# Altium project HIL_RIG_Hardware.PrjPcb (part 10 of 11)

## Sheet  3V3_High_Current.SchDoc
size A4; SheetNumber: 26; SheetTotal: 29; SPICEModelCacheDXEXORCN: <root> / <DocumentId>DXEXORCN</DocumentId> / </root>
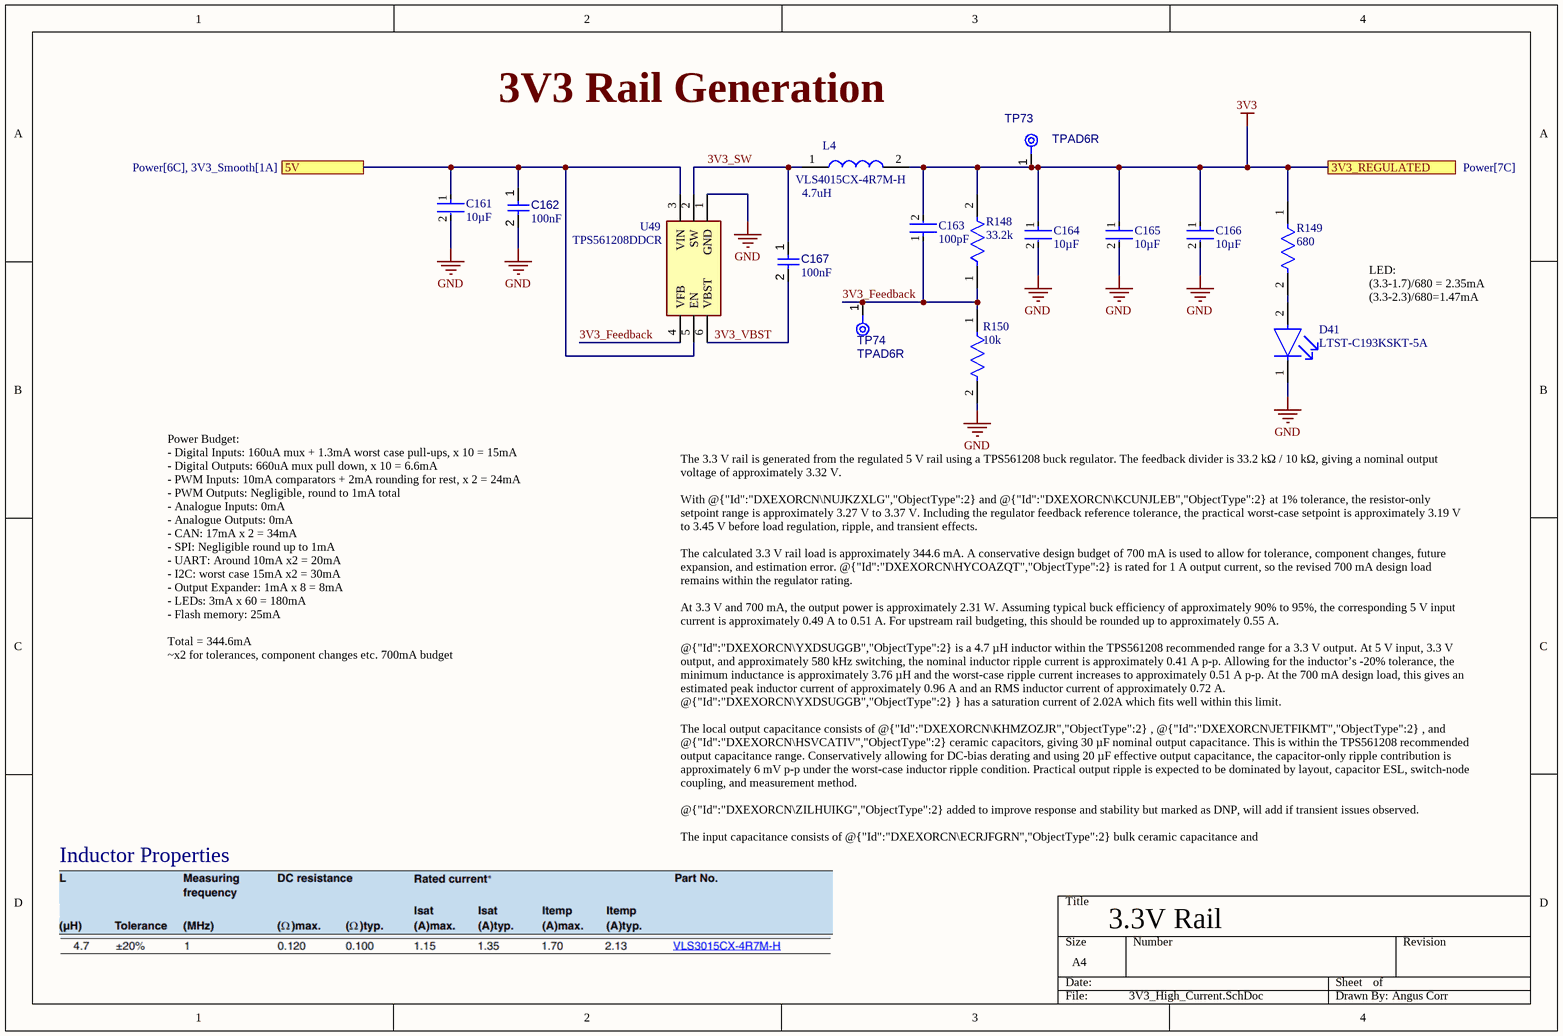
[diagram p24:  3V3_High_Current.SchDoc]

### Parts
C161  value 10µF  [FP-GRM31C-0_2-e0_3_0_8-IPC_C]  (hidden comment: GRM31CR71E106KA12L)
C162  value 100nF  [CAPC1608X90X40NL10T20]  (hidden comment: Capacitor 100 nF +/-10% 50 V 0603)
C163  value 100pF  [FP-C0603C-CF-IPC_B]  (hidden comment: C0603C101F5HACTU)
C164  value 10µF  [FP-GRM31C-0_2-e0_3_0_8-IPC_C]  (hidden comment: GRM31CR71E106KA12L)
C165  value 10µF  [FP-GRM31C-0_2-e0_3_0_8-IPC_C]  (hidden comment: GRM31CR71E106KA12L)
C166  value 10µF  [FP-GRM31C-0_2-e0_3_0_8-IPC_C]  (hidden comment: GRM31CR71E106KA12L)
C167  value 100nF  [CAPC1608X90X40NL10T20]  (hidden comment: Capacitor 100 nF +/-10% 50 V 0603)
D41  LTST-C193KSKT-5A  [FP-LTST-C193KGKT-5A-MFG]
L4  VLS4015CX-4R7M-H  [VLS4015CX100MH]
R148  value 33.2k  [FP-RT0603-IPC_C]  (hidden comment: RT0603BRD0733K2L)
R149  value 680  [FP-CRCW0603-e3-IPC_C]  (hidden comment: CRCW0603680RJNEA)
R150  value 10k  [FP-RT0603-IPC_C]  (hidden comment: RT0603BRD0710KL)
TP73  TPAD6R  [TP06R]  (no BOM)
TP74  TPAD6R  [TP06R]  (no BOM)
U49  TPS561208DDCR  [SOT95P280X110-6N]

### Ports
3V3_REGULATED (see Power[7C]), 5V (see Power[6C], 3V3_Smooth[1A])

### Nets
3V3: C163.2 C164.1 C165.1 C166.1 L4.2 R148.2 R149.1 TP73.1(TP) ; port 3V3_REGULATED
GND: C161.2 C162.2 C164.2 C165.2 C166.2 D41.1(C) R150.2 U49.1(GND)
3V3_Feedback: C163.1 R148.1 R150.1 TP74.1(TP) U49.4(VFB)
3V3_SW: C167.1 L4.1 U49.2(SW)
3V3_VBST: C167.2 U49.6(VBST)
NetC161_1: C161.1 C162.1 U49.3(VIN) U49.5(EN) ; port 5V
NetD41_2: D41.2(A) R149.2

### Notes on the sheet
- 3V3 Rail Generation
- (near L4) 4.7uH
- LED:
  (3.3-1.7)/680 = 2.35mA
  (3.3-2.3)/680=1.47mA
- Power Budget:
  - Digital Inputs: 160uA mux + 1.3mA worst case pull-ups, x 10 = 15mA
  - Digital Outputs: 660uA mux pull down, x 10 = 6.6mA
  - PWM Inputs: 10mA comparators + 2mA rounding for rest, x 2 = 24mA
  - PWM Outputs: Negligible, round to 1mA total
  - Analogue Inputs: 0mA
  - Analogue Outputs: 0mA
  - CAN: 17mA x 2 = 34mA
  - SPI: Negligible round up to 1mA
  - UART: Around 10mA x2 = 20mA
  - I2C: worst case 15mA x2 = 30mA
  - Output Expander: 1mA x 8 = 8mA
  - LEDs: 3mA x 60 = 180mA
  - Flash memory: 25mA
  Total = 344.6mA
  ~x2 for tolerances, component changes etc. 700mA budget
- The 3.3 V rail is generated from the regulated 5 V rail using a TPS561208 buck regulator. The feedback divider is 33.2 kΩ / 10 kΩ, giving a nominal output voltage of approximately 3.32 V.
  With @{"Id":"DXEXORCN\NUJKZXLG","ObjectType":2} and @{"Id":"DXEXORCN\KCUNJLEB","ObjectType":2} at 1% tolerance, the resistor-only setpoint range is approximately 3.27 V to 3.37 V. Including the regulator feedback reference tolerance, the practical worst-case setpoint is approximately 3.19 V to 3.45 V before load regulation, ripple, and transient effects.
  The calculated 3.3 V rail load is approximately 344.6 mA. A conservative design budget of 700 mA is used to allow for tolerance, component changes, future expansion, and estimation error. @{"Id":"DXEXORCN\HYCOAZQT","ObjectType":2} is rated for 1 A output current, so the revised 700 mA design load remains within the regulator rating.
  At 3.3 V and 700 mA, the output power is approximately 2.31 W. Assuming typical buck efficiency of approximately 90% to 95%, the corresponding 5 V input current is approximately 0.49 A to 0.51 A. For upstream rail budgeting, this should be rounded up to approximately 0.55 A.
  @{"Id":"DXEXORCN\YXDSUGGB","ObjectType":2} is a 4.7 µH inductor within the TPS561208 recommended range for a 3.3 V output. At 5 V input, 3.3 V output, and approximately 580 kHz switching, the nominal inductor ripple current is approximately 0.41 A p-p. Allowing for the inductor’s -20% tolerance, the minimum inductance is approximately 3.76 µH and the worst-case ripple current increases to approximately 0.51 A p-p. At the 700 mA design load, this gives an estimated peak inductor current of approximately 0.96 A and an RMS inductor current of approximately 0.72 A. @{"Id":"DXEXORCN\YXDSUGGB","ObjectType":2} } has a saturation current of 2.02A which fits well within this limit.
  The local output capacitance consists of @{"Id":"DXEXORCN\KHMZOZJR","ObjectType":2} , @{"Id":"DXEXORCN\JETFIKMT","ObjectType":2} , and @{"Id":"DXEXORCN\HSVCATIV","ObjectType":2} ceramic capacitors, giving 30 µF nominal output capacitance. This is within the TPS561208 recommended output capacitance range. Conservatively allowing for DC-bias derating and using 20 µF effective output capacitance, the capacitor-only ripple contribution is approximately 6 mV p-p under the worst-case inductor ripple condition. Practical output ripple is expected to be dominated by layout, capacitor ESL, switch-node coupling, and measurement method.
  @{"Id":"DXEXORCN\ZILHUIKG","ObjectType":2} added to improve response and stability but marked as DNP, will add if transient issues observed.
  The input capacitance consists of @{"Id":"DXEXORCN\ECRJFGRN","ObjectType":2} bulk ceramic capacitance and @{"Id":"DXEXORCN\CNOYWFMO","ObjectType":2} high-frequency ceramic decoupling. This provides local switching-current decoupling at the regulator input. At the revised 700 mA 3.3 V rail budget, the converter is expected to draw approximately 0.49 A to 0.51 A from the regulated 5 V rail.
- Inductor Properties
- 3.3V Rail
- Angus Corr

### Library data of the parts
C161 C164-C166 = CMP-001-00139-1: 25V 10uF X7R ±10% 1206 Multilayer Ceramic Capacitors MLCC - SMD/SMT ROHS; Manufacturer Lifecycle Status: IN PRODUCTION; Min Operating Temperature: -55°C; Case/Package: 1206; Pins: 2; Voltage Rating: 25V; Max Operating Temperature: 125°C; Tolerance: 10%; Mounting Technology: Surface Mount; Case Code (Imperial): 1206; Case Code (Metric): 3216; China RoHS: Compliant; Depth: 1.6mm; Dielectric Material: Ceramic; Dielectric: X7R; Height: 1.6mm; Lead Free: Lead Free; Length: 3.2mm; Lifecycle Status: Production; Material: Ceramic; Number of Terminals: 2; Packaging: Cut Tape; Radiation Hardening: No; REACH SVHC: Yes; RoHS: Compliant; Schedule B: 8532240020, 8532240020; Termination: SMD/SMT; Thickness: 1.6mm; Voltage Rating (DC): 25V; Voltage: 25V; Width: 1.6mm
C162 C167 = CMP-001-00017-6: Chip Capacitor, 100 nF, +/- 10%, 50 V, 0603 (1608 Metric); Voltage Rating: 50V; Capacitor Type: Ceramic; Tolerance: 10%; Mounting Technology: SM; Max Operating Temperature: 125°C; RoHS Compliant: True; Pins: 2; Case/Package: 0603; Min Operating Temperature: -55°C
C163 = CMP-001-00115-1: Multilayer Ceramic Capacitors MLCC - SMD/SMT 50V 100pF X8R 0603 1%; Temperature Coefficient: 30ppm/°C; Lead Free: Lead Free; Width: 800µm; Schedule B: 8532240020, 8532240020; Introduction Date: 2017-10-02; Harmonized Tariff Schedule (HTS) Code: 8532.24.00.20; Voltage Rating (DC): 50V; Lifecycle Status: Production; Number of Terminals: 2; Height: 800µm; REACH SVHC: Yes; Dielectric Material: Ceramic; Country of Origin: Mexico; Voltage Rating: 50V; Mounting Technology: Surface Mount; Length: 1.6mm; China RoHS: Compliant; RoHS: Compliant; Case/Package: 0603; Max Operating Temperature: 150°C; Export Control Classification Number (ECCN) Code: EAR99; Dielectric: X8R; Material: Ceramic; Min Operating Temperature: -55°C
D41 = CMP-007-00044-1: LED yellow 0603 wavelength 587~594.5nm light intensity 7.1~45mcd Front Mounting; Shape: Rectangular; Power Dissipation: 50mW; Peak Wavelength: 591nm; Number of Circuits: 1; Lens Style: Colorless, Diffused, Rectangular; Test Current: 5mA; Forward Voltage: 2.3V; Lens Transparency: Clear; Lens Color: Clear, Colorless; Viewing Angle: 130°; Forward Current: 30mA; Reverse Voltage: 5V; Luminous Intensity: 26.05mcd; Schedule B: 8541402000, 8541402000; Introduction Date: 2007-04-09; Min Operating Temperature: -55°C; RoHS: Compliant; Terminal Pitch: 1.5mm; Case/Package: 0603; Width: 800µm; Dominant Wavelength: 594.5nm; Pins: 2; Case Code (Imperial): 0603; Height: 350µm; Length: 1.6mm; Color: Yellow; Lead Free: Lead Free; Max Operating Temperature: 85°C; Wavelength: 594.5nm; Harmonized Tariff Schedule (HTS) Code: 8541.40.20.00; China RoHS: Compliant; Illumination Color: Yellow; Number of Terminals: 2; Radiation Hardening: No; Case Code (Metric): 1608; Number of LEDs: 1; Depth: 800µm; Lifecycle Status: Production; REACH SVHC: Yes; Mounting Technology: Surface Mount; Number of Elements: 1
L4 = CMP-006-00029-1: SMD / SMT Inductors (Coils); Manufacturer_Name: TDK; Design Item ID: VLS4015CX-4R7M-H; Manufacturer_Part_Number: VLS4015CX-4R7M-H; Datasheet Link: https://product.tdk.com/system/files/dam/doc/product/inductor/inductor/smd/catalog/inductor_automotive_power_vls4015cx-h_en.pdf; Height: 1.5mm; Source: MAX17643ATC+.SchLib; Mouser Price/Stock: https://www.mouser.co.uk/ProductDetail/TDK/VLS4015CX-4R7M-H?qs=Li%252BoUPsLEnsP0JLzqrKQYg%3D%3D; Mouser Part Number: 810-VLS4015CX-4R7M-H
R148 = CMP-009-00323-1: 100mW Thin Film Resistor 75V ±25ppm/℃ ±0.1% 33.2kΩ 0603 Chip Resistor - Surface Mount ROHS; Temperature Coefficient: 25ppm/°C; Voltage Rating (DC): 50V; Mounting Technology: Surface Mount; Working Voltage: 75V; Length: 1.6mm; Lead Free: Lead Free; REACH SVHC: Yes; Composition: Thin Film; Voltage Rating: 75V; Height: 450µm; Termination: SMD/SMT; Lifecycle Status: Production; Military Standard: Not; Depth: 800µm; Case/Package: 0603; Min Operating Temperature: -55°C; Number of Terminals: 2; Max Power Dissipation: 100mW; China RoHS: Non-Compliant; Number of Terminations: 2; Case Code (Imperial): 0603; Width: 800µm; Max Operating Temperature: 155°C; Tolerance: 0.1%; Power Rating: 100mW; Radiation Hardening: No; RoHS: Compliant; Contact Plating: Tin
R149 = CMP-009-00300-1: Fixed Resistor, Metal Glaze/Thick Film, 0.1W, 680ohm, 75V, 5% +/-Tol, Surface Mount, 0603; Power Rating: 100mW; Temperature Coefficient: 200ppm/°C; Case/Package: 0603; Voltage Rating (DC): 75V; Lifecycle Status: Production; Depth: 850µm; Introduction Date: 2005-02-16; Number of Terminations: 2; Composition: Thick Film; Export Control Classification Number (ECCN) Code: EAR99; RoHS: Compliant; Packaging: Cut Tape; Max Power Dissipation: 100mW; Max Operating Temperature: 155°C; Harmonized Tariff Schedule (HTS) Code: 8533.21.00.30; Voltage Rating: 75V; China RoHS: Non-Compliant; Width: 850µm; Height: 450µm; Schedule B: 8533210045, 8533210045; Mounting Technology: Surface Mount; Pins: 2; Radiation Hardening: No; Features: Automotive AEC-Q200; Min Operating Temperature: -55°C; Lead Free: Lead Free; Working Voltage: 75V; Military Standard: Not; Tolerance: 5%; Case Code (Imperial): 0603; Number of Terminals: 2; Weight: 2.012816mg; REACH SVHC: Yes; Length: 1.55mm; Ratings: AEC-Q200; Contact Plating: Tin; Termination: SMD/SMT; Country of Origin: Israel, Taiwan
R150 = CMP-009-00322-1: Res Thin Film 0603 10K Ohm 0.1% 1/10W |25ppm/|C SMD Paper T/R; Voltage Rating: 75V; Max Power Dissipation: 100mW; Temperature Coefficient: 25ppm/°C; Min Operating Temperature: -55°C; Case/Package: 0603; Mounting Technology: Surface Mount; Max Operating Temperature: 155°C; Tolerance: 0.1%; Case Code (Imperial): 0603; China RoHS: Non-Compliant; Composition: Thin Film; Country of Origin: Mainland China, Taiwan; Depth: 800µm; Export Control Classification Number (ECCN) Code: EAR99; Features: Moisture Resistant; Harmonized Tariff Schedule (HTS) Code: 8533.21.00.30; Height: 450µm; Introduction Date: 2008-06-09; Lead Free: Lead Free; Length: 1.6mm; Lifecycle Status: Production; Military Standard: Not; Number of Terminals: 2; Number of Terminations: 2; Power Rating: 100mW; REACH SVHC: Yes; RoHS: Compliant; Schedule B: 8533210045, 8533210045; Termination: SMD/SMT; Voltage Rating (DC): 75V; Weight: 2.012816mg; Width: 800µm; Working Voltage: 75V
TP73 TP74 = CMP-00028-00002-2: 0.6mm round; Pins: 1
U49 = CMP-033-000001-1: 4.5V to 17V Input; Manufacturer_Name: Texas Instruments; Mouser Part Number: 595-TPS561208DDCR; Arrow Price/Stock: https://www.arrow.com/en/products/tps561208ddcr/texas-instruments?utm_currency=USD&region=nac; Manufacturer_Part_Number: TPS561208DDCR; Design Item ID: TPS561208DDCR; Height: 1.1mm; Datasheet Link: http://www.ti.com/lit/gpn/tps561208; Mouser Price/Stock: https://www.mouser.co.uk/ProductDetail/Texas-Instruments/TPS561208DDCR?qs=5aG0NVq1C4wGRU8Kylr4iw%3D%3D; Source: MAX17643ATC+.SchLib; Arrow Part Number: TPS561208DDCR

## Sheet  Output_Expander.SchDoc
size A3; SheetNumber: 28; SheetTotal: 29
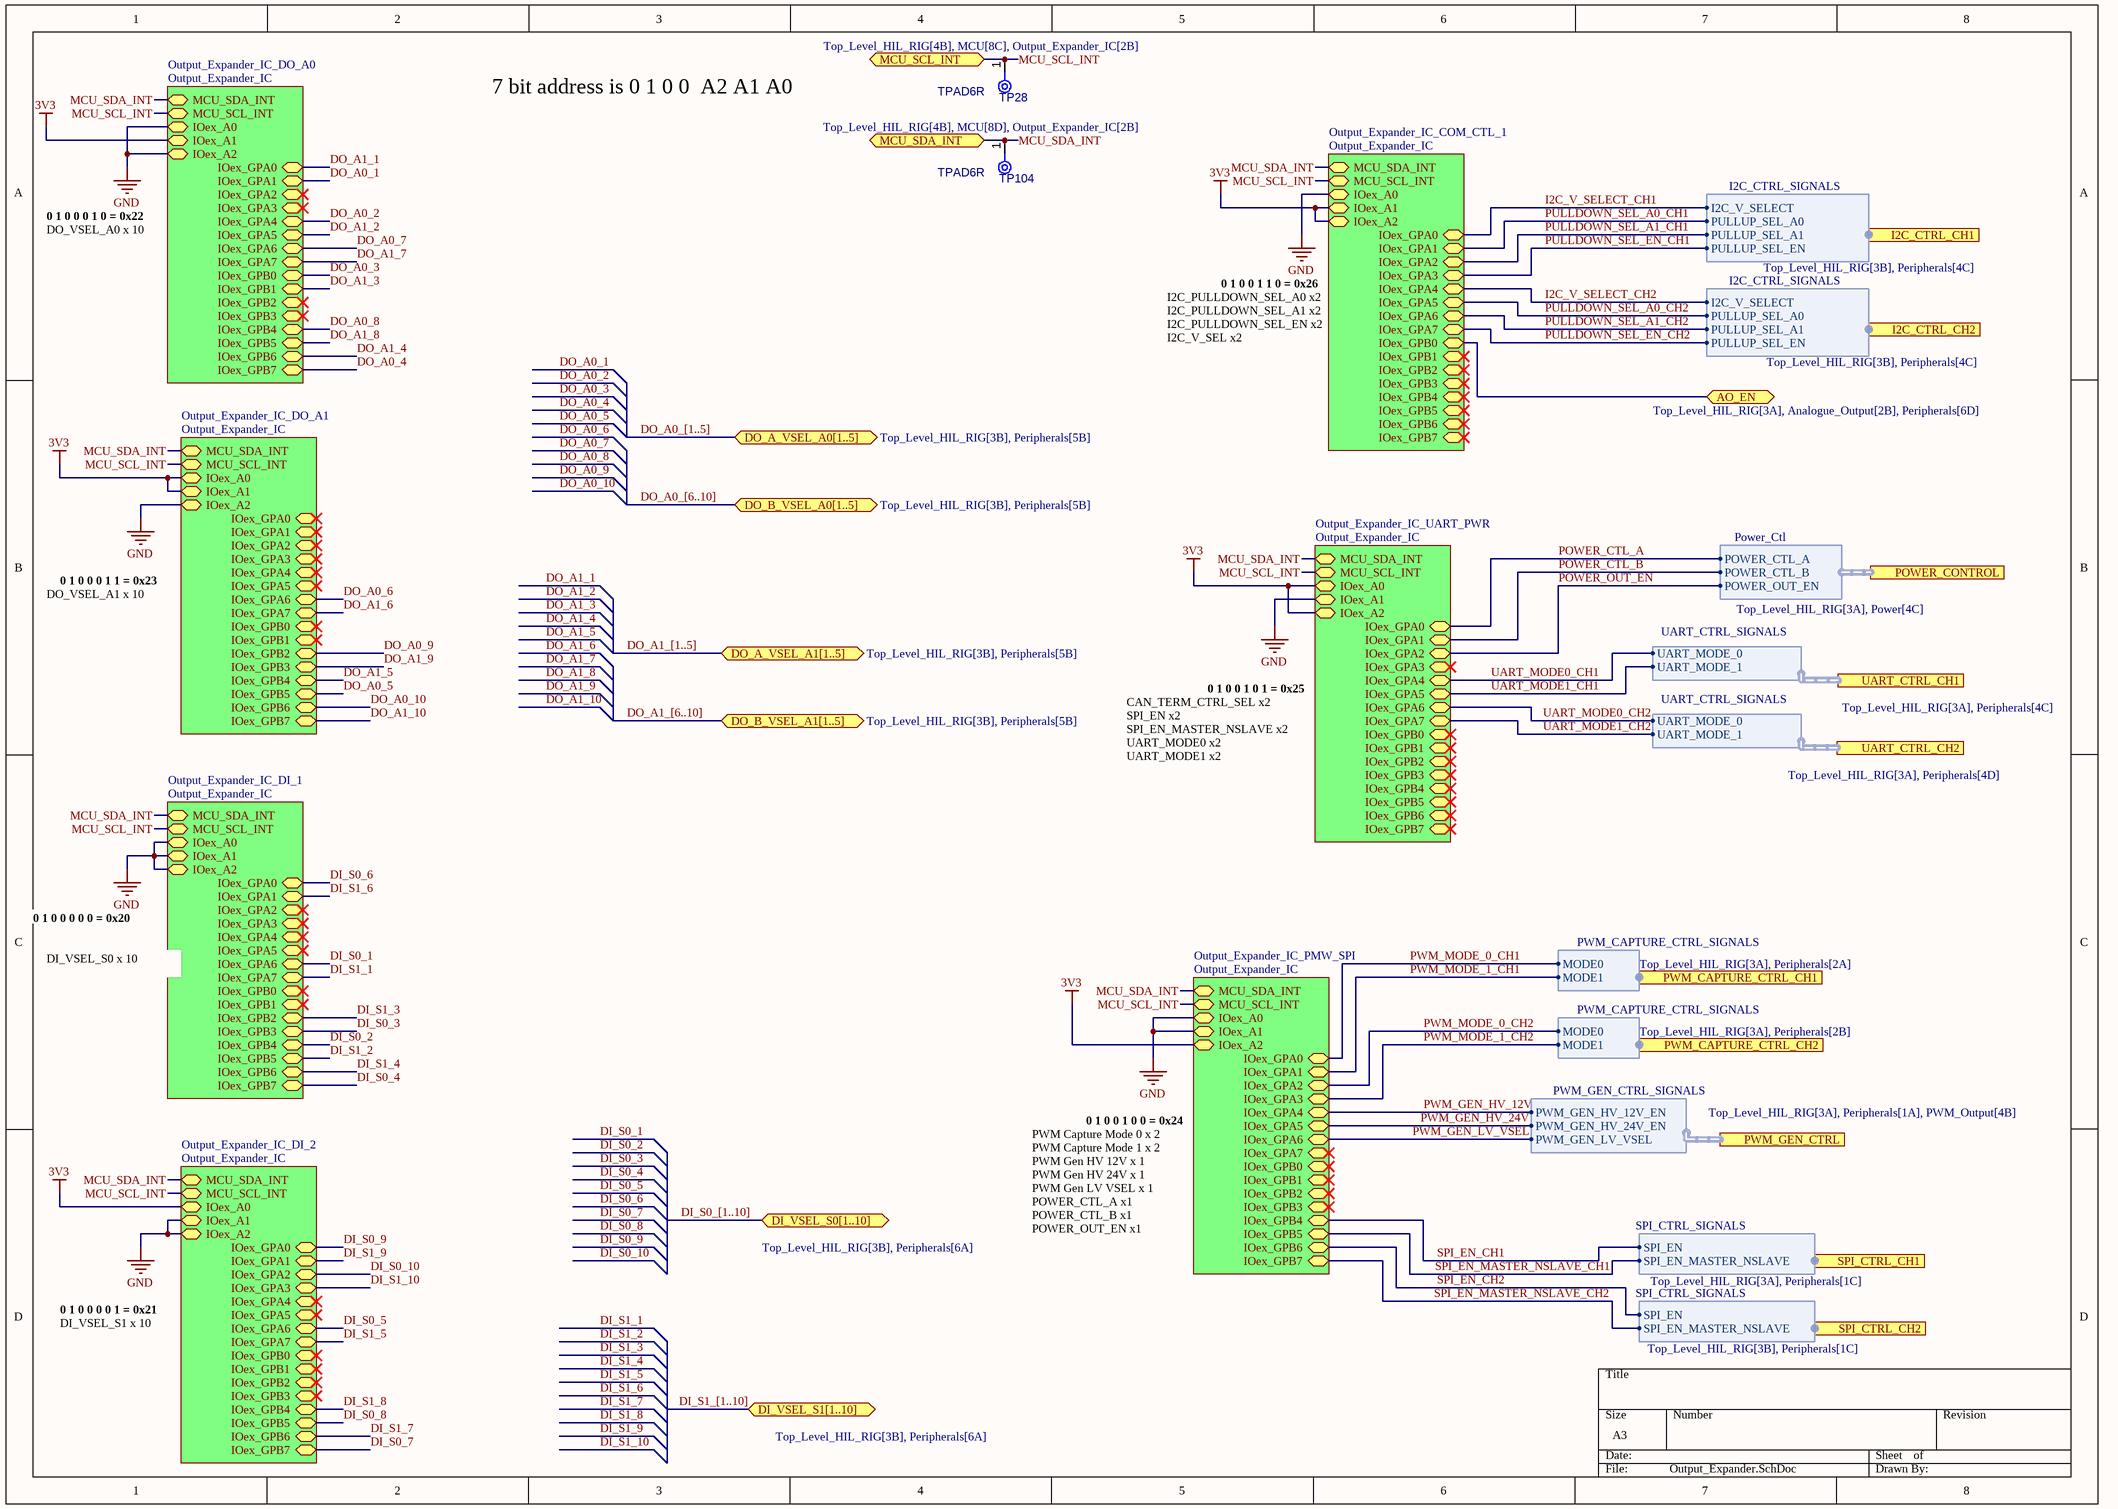
[diagram p25:  Output_Expander.SchDoc]

### Parts
TP28  TPAD6R  [TP06R]  (no BOM)
TP104  TPAD6R  [TP06R]  (no BOM)

### Sub-sheets
Output_Expander_IC_COM_CTL_1 = Output_Expander_IC (file not in this document): MCU_SDA_INT (bidir), MCU_SCL_INT (bidir), IOex_A0 (bidir), IOex_A1 (bidir), IOex_A2 (bidir), IOex_GPA0 (bidir), IOex_GPA1 (bidir), IOex_GPA2 (bidir), IOex_GPA3 (bidir), IOex_GPA4 (bidir), IOex_GPA5 (bidir), IOex_GPA6 (bidir), IOex_GPA7 (bidir), IOex_GPB0 (bidir), IOex_GPB1 (bidir), IOex_GPB3 (bidir), IOex_GPB4 (bidir), IOex_GPB5 (bidir), IOex_GPB6 (bidir), IOex_GPB2 (bidir), IOex_GPB7 (bidir)
Output_Expander_IC_DI_1 = Output_Expander_IC (file not in this document): MCU_SDA_INT (bidir), MCU_SCL_INT (bidir), IOex_A0 (bidir), IOex_A1 (bidir), IOex_A2 (bidir), IOex_GPA0 (bidir), IOex_GPA1 (bidir), IOex_GPA2 (bidir), IOex_GPA3 (bidir), IOex_GPA4 (bidir), IOex_GPA5 (bidir), IOex_GPA6 (bidir), IOex_GPA7 (bidir), IOex_GPB0 (bidir), IOex_GPB1 (bidir), IOex_GPB3 (bidir), IOex_GPB4 (bidir), IOex_GPB5 (bidir), IOex_GPB6 (bidir), IOex_GPB2 (bidir), IOex_GPB7 (bidir)
Output_Expander_IC_DI_2 = Output_Expander_IC (file not in this document): MCU_SDA_INT (bidir), MCU_SCL_INT (bidir), IOex_A0 (bidir), IOex_A1 (bidir), IOex_A2 (bidir), IOex_GPA0 (bidir), IOex_GPA1 (bidir), IOex_GPA2 (bidir), IOex_GPA3 (bidir), IOex_GPA4 (bidir), IOex_GPA5 (bidir), IOex_GPA6 (bidir), IOex_GPA7 (bidir), IOex_GPB0 (bidir), IOex_GPB1 (bidir), IOex_GPB3 (bidir), IOex_GPB4 (bidir), IOex_GPB5 (bidir), IOex_GPB6 (bidir), IOex_GPB2 (bidir), IOex_GPB7 (bidir)
Output_Expander_IC_DO_A0 = Output_Expander_IC (file not in this document): MCU_SDA_INT (bidir), MCU_SCL_INT (bidir), IOex_A0 (bidir), IOex_A1 (bidir), IOex_A2 (bidir), IOex_GPA0 (bidir), IOex_GPA1 (bidir), IOex_GPA2 (bidir), IOex_GPA3 (bidir), IOex_GPA4 (bidir), IOex_GPA5 (bidir), IOex_GPA6 (bidir), IOex_GPA7 (bidir), IOex_GPB0 (bidir), IOex_GPB1 (bidir), IOex_GPB3 (bidir), IOex_GPB4 (bidir), IOex_GPB5 (bidir), IOex_GPB6 (bidir), IOex_GPB2 (bidir), IOex_GPB7 (bidir)
Output_Expander_IC_DO_A1 = Output_Expander_IC (file not in this document): MCU_SDA_INT (bidir), MCU_SCL_INT (bidir), IOex_A0 (bidir), IOex_A1 (bidir), IOex_A2 (bidir), IOex_GPA0 (bidir), IOex_GPA1 (bidir), IOex_GPA2 (bidir), IOex_GPA3 (bidir), IOex_GPA4 (bidir), IOex_GPA5 (bidir), IOex_GPA6 (bidir), IOex_GPB0 (bidir), IOex_GPB1 (bidir), IOex_GPB3 (bidir), IOex_GPB4 (bidir), IOex_GPB5 (bidir), IOex_GPB6 (bidir), IOex_GPB2 (bidir), IOex_GPB7 (bidir), IOex_GPA7 (bidir)
Output_Expander_IC_PMW_SPI = Output_Expander_IC (file not in this document): MCU_SDA_INT (bidir), MCU_SCL_INT (bidir), IOex_A0 (bidir), IOex_A1 (bidir), IOex_A2 (bidir), IOex_GPA0 (bidir), IOex_GPA1 (bidir), IOex_GPA2 (bidir), IOex_GPA3 (bidir), IOex_GPA4 (bidir), IOex_GPA5 (bidir), IOex_GPA6 (bidir), IOex_GPA7 (bidir), IOex_GPB0 (bidir), IOex_GPB1 (bidir), IOex_GPB3 (bidir), IOex_GPB4 (bidir), IOex_GPB5 (bidir), IOex_GPB6 (bidir), IOex_GPB2 (bidir), IOex_GPB7 (bidir)
Output_Expander_IC_UART_PWR = Output_Expander_IC (file not in this document): MCU_SDA_INT (bidir), MCU_SCL_INT (bidir), IOex_A0 (bidir), IOex_A1 (bidir), IOex_A2 (bidir), IOex_GPA0 (bidir), IOex_GPA1 (bidir), IOex_GPA2 (bidir), IOex_GPA3 (bidir), IOex_GPA4 (bidir), IOex_GPA5 (bidir), IOex_GPA6 (bidir), IOex_GPA7 (bidir), IOex_GPB0 (bidir), IOex_GPB1 (bidir), IOex_GPB3 (bidir), IOex_GPB4 (bidir), IOex_GPB5 (bidir), IOex_GPB6 (bidir), IOex_GPB2 (bidir), IOex_GPB7 (bidir)

### Ports
AO_EN (bidir, see Top_Level_HIL_RIG[3A], Analogue_Output[2B], Peripherals[6D]), DI_VSEL_S0[1..10] (bidir, see Top_Level_HIL_RIG[3B], Peripherals[6A]), DI_VSEL_S1[1..10] (bidir, see Top_Level_HIL_RIG[3B], Peripherals[6A]), DO_A_VSEL_A0[1..5] (bidir, see Top_Level_HIL_RIG[3B], Peripherals[5B]), DO_A_VSEL_A1[1..5] (bidir, see Top_Level_HIL_RIG[3B], Peripherals[5B]), DO_B_VSEL_A0[1..5] (bidir, see Top_Level_HIL_RIG[3B], Peripherals[5B]), DO_B_VSEL_A1[1..5] (bidir, see Top_Level_HIL_RIG[3B], Peripherals[5B]), I2C_CTRL_CH1 (harness I2C_CTRL_SIGNALS, see Top_Level_HIL_RIG[3B], Peripherals[4C]), I2C_CTRL_CH2 (harness I2C_CTRL_SIGNALS, see Top_Level_HIL_RIG[3B], Peripherals[4C]), MCU_SCL_INT (bidir, see Top_Level_HIL_RIG[4B], MCU[8C], Output_Expander_IC[2B]), MCU_SDA_INT (bidir, see Top_Level_HIL_RIG[4B], MCU[8D], Output_Expander_IC[2B]), POWER_CONTROL (harness Power_Ctl, see Top_Level_HIL_RIG[3A], Power[4C]), PWM_CAPTURE_CTRL_CH1 (in, harness PWM_CAPTURE_CTRL_SIGNALS, see Top_Level_HIL_RIG[3A], Peripherals[2A]), PWM_CAPTURE_CTRL_CH2 (in, harness PWM_CAPTURE_CTRL_SIGNALS, see Top_Level_HIL_RIG[3A], Peripherals[2B]), PWM_GEN_CTRL (harness PWM_GEN_CTRL_SIGNALS, see Top_Level_HIL_RIG[3A], Peripherals[1A], PWM_Output[4B]), SPI_CTRL_CH1 (harness SPI_CTRL_SIGNALS, see Top_Level_HIL_RIG[3A], Peripherals[1C]), SPI_CTRL_CH2 (harness SPI_CTRL_SIGNALS, see Top_Level_HIL_RIG[3B], Peripherals[1C]), UART_CTRL_CH1 (harness UART_CTRL_SIGNALS, see Top_Level_HIL_RIG[3A], Peripherals[4C]), UART_CTRL_CH2 (harness UART_CTRL_SIGNALS, see Top_Level_HIL_RIG[3A], Peripherals[4D])

### Harnesses
I2C_CTRL_SIGNALS: PULLUP_SEL_A0, PULLUP_SEL_EN, PULLUP_SEL_A1, I2C_V_SELECT
SPI_CTRL_SIGNALS: SPI_EN, SPI_EN_MASTER_NSLAVE
UART_CTRL_SIGNALS: UART_MODE_0, UART_MODE_1
PWM_CAPTURE_CTRL_SIGNALS: MODE1, MODE0
PWM_GEN_CTRL_SIGNALS: PWM_GEN_HV_12V_EN, PWM_GEN_HV_24V_EN, PWM_GEN_LV_VSEL
Power_Ctl: POWER_OUT_EN, POWER_CTL_B, POWER_CTL_A

### Nets
3V3: sheet Output_Expander_IC_DI_2/IOex_A0, sheet Output_Expander_IC_DO_A0/IOex_A1, sheet Output_Expander_IC_DO_A1/IOex_A0, sheet Output_Expander_IC_DO_A1/IOex_A1, sheet Output_Expander_IC_COM_CTL_1/IOex_A1, sheet Output_Expander_IC_COM_CTL_1/IOex_A2, sheet Output_Expander_IC_UART_PWR/IOex_A0, sheet Output_Expander_IC_UART_PWR/IOex_A2, sheet Output_Expander_IC_PMW_SPI/IOex_A2
GND: sheet Output_Expander_IC_DI_1/IOex_A0, sheet Output_Expander_IC_DI_1/IOex_A1, sheet Output_Expander_IC_DI_1/IOex_A2, sheet Output_Expander_IC_DI_2/IOex_A1, sheet Output_Expander_IC_DI_2/IOex_A2, sheet Output_Expander_IC_DO_A0/IOex_A0, sheet Output_Expander_IC_DO_A0/IOex_A2, sheet Output_Expander_IC_DO_A1/IOex_A2, sheet Output_Expander_IC_COM_CTL_1/IOex_A0, sheet Output_Expander_IC_UART_PWR/IOex_A1, sheet Output_Expander_IC_PMW_SPI/IOex_A0, sheet Output_Expander_IC_PMW_SPI/IOex_A1
DI_S0_1: sheet Output_Expander_IC_DI_1/IOex_GPA6
DI_S0_2: sheet Output_Expander_IC_DI_1/IOex_GPB4
DI_S0_3: sheet Output_Expander_IC_DI_1/IOex_GPB3
DI_S0_4: sheet Output_Expander_IC_DI_1/IOex_GPB7
DI_S0_5: sheet Output_Expander_IC_DI_2/IOex_GPA6
DI_S0_6: sheet Output_Expander_IC_DI_1/IOex_GPA0
DI_S0_7: sheet Output_Expander_IC_DI_2/IOex_GPB7
DI_S0_8: sheet Output_Expander_IC_DI_2/IOex_GPB5
DI_S0_9: sheet Output_Expander_IC_DI_2/IOex_GPA0
DI_S0_10: sheet Output_Expander_IC_DI_2/IOex_GPA2
DI_S1_1: sheet Output_Expander_IC_DI_1/IOex_GPA7
DI_S1_2: sheet Output_Expander_IC_DI_1/IOex_GPB5
DI_S1_3: sheet Output_Expander_IC_DI_1/IOex_GPB2
DI_S1_4: sheet Output_Expander_IC_DI_1/IOex_GPB6
DI_S1_5: sheet Output_Expander_IC_DI_2/IOex_GPA7
DI_S1_6: sheet Output_Expander_IC_DI_1/IOex_GPA1
DI_S1_7: sheet Output_Expander_IC_DI_2/IOex_GPB6
DI_S1_8: sheet Output_Expander_IC_DI_2/IOex_GPB4
DI_S1_9: sheet Output_Expander_IC_DI_2/IOex_GPA1
DI_S1_10: sheet Output_Expander_IC_DI_2/IOex_GPA3
DO_A0_1: sheet Output_Expander_IC_DO_A0/IOex_GPA1
DO_A0_2: sheet Output_Expander_IC_DO_A0/IOex_GPA4
DO_A0_3: sheet Output_Expander_IC_DO_A0/IOex_GPB0
DO_A0_4: sheet Output_Expander_IC_DO_A0/IOex_GPB7
DO_A0_5: sheet Output_Expander_IC_DO_A1/IOex_GPB5
DO_A0_6: sheet Output_Expander_IC_DO_A1/IOex_GPA6
DO_A0_7: sheet Output_Expander_IC_DO_A0/IOex_GPA6
DO_A0_8: sheet Output_Expander_IC_DO_A0/IOex_GPB4
DO_A0_9: sheet Output_Expander_IC_DO_A1/IOex_GPB2
DO_A0_10: sheet Output_Expander_IC_DO_A1/IOex_GPB6
DO_A1_1: sheet Output_Expander_IC_DO_A0/IOex_GPA0
DO_A1_2: sheet Output_Expander_IC_DO_A0/IOex_GPA5
DO_A1_3: sheet Output_Expander_IC_DO_A0/IOex_GPB1
DO_A1_4: sheet Output_Expander_IC_DO_A0/IOex_GPB6
DO_A1_5: sheet Output_Expander_IC_DO_A1/IOex_GPB4
DO_A1_6: sheet Output_Expander_IC_DO_A1/IOex_GPA7
DO_A1_7: sheet Output_Expander_IC_DO_A0/IOex_GPA7
DO_A1_8: sheet Output_Expander_IC_DO_A0/IOex_GPB5
DO_A1_9: sheet Output_Expander_IC_DO_A1/IOex_GPB3
DO_A1_10: sheet Output_Expander_IC_DO_A1/IOex_GPB7
I2C_V_SELECT_CH1: sheet Output_Expander_IC_COM_CTL_1/IOex_GPA0, port I2C_CTRL_CH1.I2C_V_SELECT
I2C_V_SELECT_CH2: sheet Output_Expander_IC_COM_CTL_1/IOex_GPA4, port I2C_CTRL_CH2.I2C_V_SELECT
MCU_SCL_INT: TP28.1(TP) ; port MCU_SCL_INT, sheet Output_Expander_IC_DI_1/MCU_SCL_INT, sheet Output_Expander_IC_DI_2/MCU_SCL_INT, sheet Output_Expander_IC_DO_A0/MCU_SCL_INT, sheet Output_Expander_IC_DO_A1/MCU_SCL_INT, sheet Output_Expander_IC_COM_CTL_1/MCU_SCL_INT, sheet Output_Expander_IC_UART_PWR/MCU_SCL_INT, sheet Output_Expander_IC_PMW_SPI/MCU_SCL_INT
MCU_SDA_INT: TP104.1(TP) ; port MCU_SDA_INT, sheet Output_Expander_IC_DI_1/MCU_SDA_INT, sheet Output_Expander_IC_DI_2/MCU_SDA_INT, sheet Output_Expander_IC_DO_A0/MCU_SDA_INT, sheet Output_Expander_IC_DO_A1/MCU_SDA_INT, sheet Output_Expander_IC_COM_CTL_1/MCU_SDA_INT, sheet Output_Expander_IC_UART_PWR/MCU_SDA_INT, sheet Output_Expander_IC_PMW_SPI/MCU_SDA_INT
POWER_CTL_A: sheet Output_Expander_IC_UART_PWR/IOex_GPA0, port POWER_CONTROL.POWER_CTL_A
POWER_CTL_B: sheet Output_Expander_IC_UART_PWR/IOex_GPA1, port POWER_CONTROL.POWER_CTL_B
POWER_OUT_EN: sheet Output_Expander_IC_UART_PWR/IOex_GPA2, port POWER_CONTROL.POWER_OUT_EN
PULLDOWN_SEL_A0_CH1: sheet Output_Expander_IC_COM_CTL_1/IOex_GPA1, port I2C_CTRL_CH1.PULLUP_SEL_A0
PULLDOWN_SEL_A0_CH2: sheet Output_Expander_IC_COM_CTL_1/IOex_GPA5, port I2C_CTRL_CH2.PULLUP_SEL_A0
PULLDOWN_SEL_A1_CH1: sheet Output_Expander_IC_COM_CTL_1/IOex_GPA2, port I2C_CTRL_CH1.PULLUP_SEL_A1
PULLDOWN_SEL_A1_CH2: sheet Output_Expander_IC_COM_CTL_1/IOex_GPA6, port I2C_CTRL_CH2.PULLUP_SEL_A1
PULLDOWN_SEL_EN_CH1: sheet Output_Expander_IC_COM_CTL_1/IOex_GPA3, port I2C_CTRL_CH1.PULLUP_SEL_EN
PULLDOWN_SEL_EN_CH2: sheet Output_Expander_IC_COM_CTL_1/IOex_GPA7, port I2C_CTRL_CH2.PULLUP_SEL_EN
PWM_GEN_HV_12V: sheet Output_Expander_IC_PMW_SPI/IOex_GPA4, port PWM_GEN_CTRL.PWM_GEN_HV_12V_EN
PWM_GEN_HV_24V: sheet Output_Expander_IC_PMW_SPI/IOex_GPA5, port PWM_GEN_CTRL.PWM_GEN_HV_24V_EN
PWM_GEN_LV_VSEL: sheet Output_Expander_IC_PMW_SPI/IOex_GPA6, port PWM_GEN_CTRL.PWM_GEN_LV_VSEL
PWM_MODE_0_CH1: sheet Output_Expander_IC_PMW_SPI/IOex_GPA0, port PWM_CAPTURE_CTRL_CH1.MODE0
PWM_MODE_0_CH2: sheet Output_Expander_IC_PMW_SPI/IOex_GPA2, port PWM_CAPTURE_CTRL_CH2.MODE0
PWM_MODE_1_CH1: sheet Output_Expander_IC_PMW_SPI/IOex_GPA1, port PWM_CAPTURE_CTRL_CH1.MODE1
PWM_MODE_1_CH2: sheet Output_Expander_IC_PMW_SPI/IOex_GPA3, port PWM_CAPTURE_CTRL_CH2.MODE1
SPI_EN_CH1: sheet Output_Expander_IC_PMW_SPI/IOex_GPB4, port SPI_CTRL_CH1.SPI_EN
SPI_EN_CH2: sheet Output_Expander_IC_PMW_SPI/IOex_GPB6, port SPI_CTRL_CH2.SPI_EN
SPI_EN_MASTER_NSLAVE_CH1: sheet Output_Expander_IC_PMW_SPI/IOex_GPB5, port SPI_CTRL_CH1.SPI_EN_MASTER_NSLAVE
SPI_EN_MASTER_NSLAVE_CH2: sheet Output_Expander_IC_PMW_SPI/IOex_GPB7, port SPI_CTRL_CH2.SPI_EN_MASTER_NSLAVE
UART_MODE0_CH1: sheet Output_Expander_IC_UART_PWR/IOex_GPA4, port UART_CTRL_CH1.UART_MODE_0
UART_MODE0_CH2: sheet Output_Expander_IC_UART_PWR/IOex_GPA6, port UART_CTRL_CH2.UART_MODE_0
UART_MODE1_CH1: sheet Output_Expander_IC_UART_PWR/IOex_GPA5, port UART_CTRL_CH1.UART_MODE_1
UART_MODE1_CH2: sheet Output_Expander_IC_UART_PWR/IOex_GPA7, port UART_CTRL_CH2.UART_MODE_1
(unnamed): port AO_EN, sheet Output_Expander_IC_COM_CTL_1/IOex_GPB0

### Buses and harness runs
bus DI_S0_[1..10] = port DI_VSEL_S0[1..10]
bus DI_S1_[1..10] = port DI_VSEL_S1[1..10]
bus DO_A0_[1..5] = port DO_A_VSEL_A0[1..5]
bus DO_A0_[6..10] = port DO_B_VSEL_A0[1..5]
bus DO_A1_[1..5] = port DO_A_VSEL_A1[1..5]
bus DO_A1_[6..10] = port DO_B_VSEL_A1[1..5]

### Notes on the sheet
- 7 bit address is 0 1 0 0  A2 A1 A0
- 0 1 0 0 0 1 0 = 0x22
- DO_VSEL_A0 x 10
- 0 1 0 0 1 1 0 = 0x26
- I2C_PULLDOWN_SEL_A0 x2
  I2C_PULLDOWN_SEL_A1 x2
  I2C_PULLDOWN_SEL_EN x2
  I2C_V_SEL x2
- 0 1 0 0 0 1 1 = 0x23
- DO_VSEL_A1 x 10
- 0 1 0 0 1 0 1 = 0x25
- CAN_TERM_CTRL_SEL x2
  SPI_EN x2
  SPI_EN_MASTER_NSLAVE x2
  UART_MODE0 x2
  UART_MODE1 x2
- 0 1 0 0 0 0 0 = 0x20
- DI_VSEL_S0 x 10
- 0 1 0 0 1 0 0 = 0x24
- PWM Capture Mode 0 x 2
  PWM Capture Mode 1 x 2
  PWM Gen HV 12V x 1
  PWM Gen HV 24V x 1
  PWM Gen LV VSEL x 1
  POWER_CTL_A x1
  POWER_CTL_B x1
  POWER_OUT_EN x1
- 0 1 0 0 0 0 1 = 0x21
- DI_VSEL_S1 x 10

### Library data of the parts
TP28 TP104 = CMP-00028-00002-2: 0.6mm round; Pins: 1

## Sheet  I2C.SchDoc
size A3; SheetNumber: 20; SheetTotal: 29
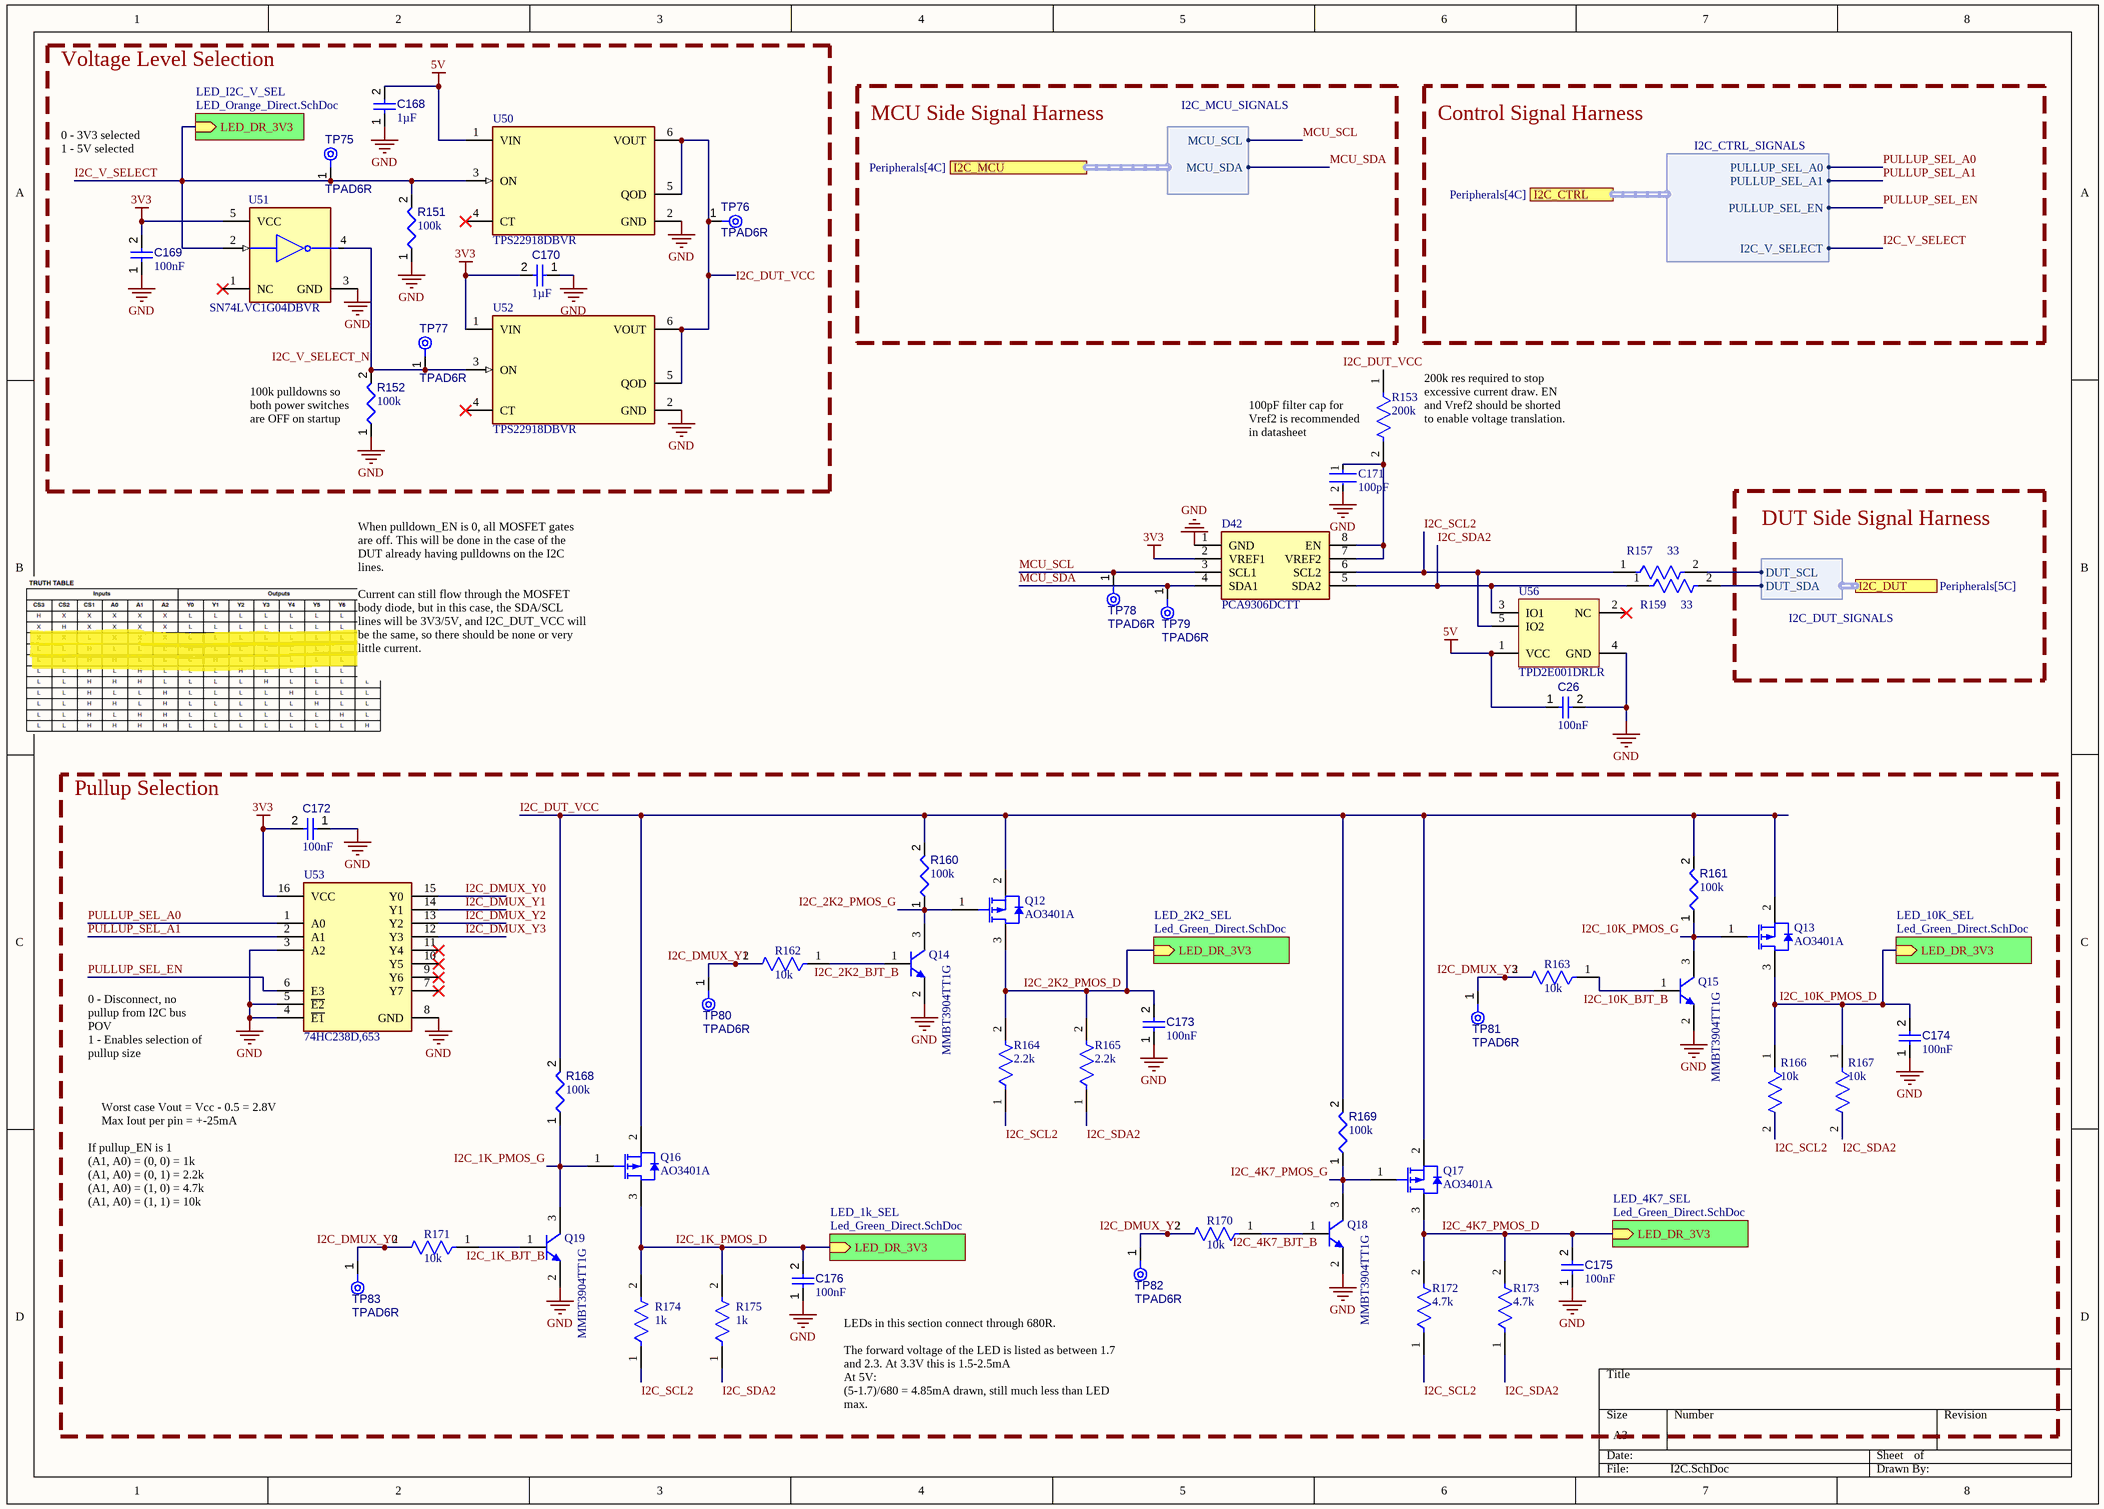
[diagram p26:  I2C.SchDoc]

### Parts
C26  value 100nF  [CAPC1608X90X40NL10T20]  (hidden comment: Capacitor 100 nF +/-10% 50 V 0603)
C168  value 1µF  [CAPC1608X90X40LL10T20]  (hidden comment: Capacitor 1 uF +/- 10% 25 V 0603)
C169  value 100nF  [CAPC1608X90X40NL10T20]  (hidden comment: Capacitor 100 nF +/-10% 50 V 0603)
C170  value 1µF  [CAPC1608X90X40LL10T20]  (hidden comment: Capacitor 1 uF +/- 10% 25 V 0603)
C171  value 100pF  [FP-C0603C-CF-IPC_B]  (hidden comment: C0603C101F5GACTU)
C172  value 100nF  [CAPC1608X90X40NL10T20]  (hidden comment: Capacitor 100 nF +/-10% 50 V 0603)
C173  value 100nF  [CAPC1608X90X40NL10T20]  (hidden comment: Capacitor 100 nF +/-10% 50 V 0603)
C174  value 100nF  [CAPC1608X90X40NL10T20]  (hidden comment: Capacitor 100 nF +/-10% 50 V 0603)
C175  value 100nF  [CAPC1608X90X40NL10T20]  (hidden comment: Capacitor 100 nF +/-10% 50 V 0603)
C176  value 100nF  [CAPC1608X90X40NL10T20]  (hidden comment: Capacitor 100 nF +/-10% 50 V 0603)
D42  PCA9306DCTT  [SOP65P400X130-8N]
Q12  AO3401A  [AO-SOT-23-3L_V]
Q13  AO3401A  [AO-SOT-23-3L_V]
Q14  MMBT3904TT1G  [ONSC-SC-75-3-463-01_V]
Q15  MMBT3904TT1G  [ONSC-SC-75-3-463-01_V]
Q16  AO3401A  [AO-SOT-23-3L_V]
Q17  AO3401A  [AO-SOT-23-3L_V]
Q18  MMBT3904TT1G  [ONSC-SC-75-3-463-01_V]
Q19  MMBT3904TT1G  [ONSC-SC-75-3-463-01_V]
R151  value 100k  [FP-AC0603-IPC_C]  (hidden comment: AC0603FR-07100KL)
R152  value 100k  [FP-AC0603-IPC_C]  (hidden comment: AC0603FR-07100KL)
R153  value 200k  [FP-AT0603-IPC_A]  (hidden comment: AT0603BRD07200KL)
R157  value 33  [FP-AC0603-IPC_C]  (hidden comment: AC0603FR-0733RL)
R159  value 33  [FP-AC0603-IPC_C]  (hidden comment: AC0603FR-0733RL)
R160  value 100k  [FP-AC0603-IPC_C]  (hidden comment: AC0603FR-07100KL)
R161  value 100k  [FP-AC0603-IPC_C]  (hidden comment: AC0603FR-07100KL)
R162  value 10k  [FP-RT0603-IPC_C]  (hidden comment: RT0603BRD0710KL)
R163  value 10k  [FP-RT0603-IPC_C]  (hidden comment: RT0603BRD0710KL)
R164  value 2.2k  [FP-RT0603-IPC_C]  (hidden comment: RT0603BRD072K2L)
R165  value 2.2k  [FP-RT0603-IPC_C]  (hidden comment: RT0603BRD072K2L)
R166  value 10k  [FP-RT0603-IPC_C]  (hidden comment: RT0603BRD0710KL)
R167  value 10k  [FP-RT0603-IPC_C]  (hidden comment: RT0603BRD0710KL)
R168  value 100k  [FP-AC0603-IPC_C]  (hidden comment: AC0603FR-07100KL)
R169  value 100k  [FP-AC0603-IPC_C]  (hidden comment: AC0603FR-07100KL)
R170  value 10k  [FP-RT0603-IPC_C]  (hidden comment: RT0603BRD0710KL)
R171  value 10k  [FP-RT0603-IPC_C]  (hidden comment: RT0603BRD0710KL)
R172  value 4.7k  [FP-RT0603-IPC_C]  (hidden comment: RT0603BRD074K7L)
R173  value 4.7k  [FP-RT0603-IPC_C]  (hidden comment: RT0603BRD074K7L)
R174  value 1k  [FP-RT0603-IPC_B]  (hidden comment: RT0603BRD071KL)
R175  value 1k  [FP-RT0603-IPC_B]  (hidden comment: RT0603BRD071KL)
TP75  TPAD6R  [TP06R]  (no BOM)
TP76  TPAD6R  [TP06R]  (no BOM)
TP77  TPAD6R  [TP06R]  (no BOM)
TP78  TPAD6R  [TP06R]  (no BOM)
TP79  TPAD6R  [TP06R]  (no BOM)
TP80  TPAD6R  [TP06R]  (no BOM)
TP81  TPAD6R  [TP06R]  (no BOM)
TP82  TPAD6R  [TP06R]  (no BOM)
TP83  TPAD6R  [TP06R]  (no BOM)
U50  TPS22918DBVR  [FP-DBV0006A-IPC_B]
U51  SN74LVC1G04DBVR  [FP-DBV0005A-IPC_B]
U52  TPS22918DBVR  [FP-DBV0006A-IPC_B]
U53  74HC238D,653  [74HC238D653]
U56  TPD2E001DRLR  [DRL0005A_M]

### Blocks framed on the sheet
Voltage Level Selection: C168-C170 R151 R152 TP75-TP77 U50-U52
Pullup Selection: C172-C176 Q12-Q19 R160-R175 TP80-TP83 U53

### Sub-sheets
LED_1k_SEL = Led_Green_Direct.SchDoc (file not in this document): LED_DR_3V3 (in)
LED_2K2_SEL = Led_Green_Direct.SchDoc (file not in this document): LED_DR_3V3 (in)
LED_4K7_SEL = Led_Green_Direct.SchDoc (file not in this document): LED_DR_3V3 (in)
LED_10K_SEL = Led_Green_Direct.SchDoc (file not in this document): LED_DR_3V3 (in)
LED_I2C_V_SEL = LED_Orange_Direct.SchDoc (file not in this document): LED_DR_3V3 (in)

### Ports
I2C_CTRL (harness I2C_CTRL_SIGNALS, see Peripherals[4C]), I2C_DUT (harness I2C_DUT_SIGNALS, see Peripherals[5C]), I2C_MCU (harness I2C_MCU_SIGNALS, see Peripherals[4C])

### Harnesses
I2C_MCU_SIGNALS: MCU_SCL, MCU_SDA
I2C_DUT_SIGNALS: DUT_SCL, DUT_SDA
I2C_CTRL_SIGNALS: PULLUP_SEL_A0, PULLUP_SEL_A1, PULLUP_SEL_EN, I2C_V_SELECT

### Nets
3V3: C169.2 C170.2 C172.2 D42.2(VREF1) U51.5(VCC) U52.1(VIN) U53.16(VCC)
5V: C26.1 C168.2 U50.1(VIN) U56.1(VCC)
GND: C26.2 C168.1 C169.1 C170.1 C171.2 C172.1 C173.1 C174.1 C175.1 C176.1 D42.1(GND) Q14.2(E) Q15.2(E) Q18.2(E) Q19.2(E) R151.1 R152.1 U50.2(GND) U51.3(GND) U52.2(GND) U53.3(A2) U53.4(~{E1}) U53.5(~{E2}) U53.8(GND) U56.4(GND)
I2C_1K_BJT_B: Q19.1(B) R171.1
I2C_1K_PMOS_D: C176.2 Q16.3(DRAIN) R174.2 R175.2 ; sheet LED_1k_SEL/LED_DR_3V3
I2C_1K_PMOS_G: Q16.1(GATE) Q19.3(C) R168.1
I2C_2K2_BJT_B: Q14.1(B) R162.1
I2C_2K2_PMOS_D: C173.2 Q12.3(DRAIN) R164.2 R165.2 ; sheet LED_2K2_SEL/LED_DR_3V3
I2C_2K2_PMOS_G: Q12.1(GATE) Q14.3(C) R160.1
I2C_4K7_BJT_B: Q18.1(B) R170.1
I2C_4K7_PMOS_D: C175.2 Q17.3(DRAIN) R172.2 R173.2 ; sheet LED_4K7_SEL/LED_DR_3V3
I2C_4K7_PMOS_G: Q17.1(GATE) Q18.3(C) R169.1
I2C_10K_BJT_B: Q15.1(B) R163.1
I2C_10K_PMOS_D: C174.2 Q13.3(DRAIN) R166.1 R167.1 ; sheet LED_10K_SEL/LED_DR_3V3
I2C_10K_PMOS_G: Q13.1(GATE) Q15.3(C) R161.1
I2C_DMUX_Y0: R171.2 TP83.1(TP) U53.15(Y0)
I2C_DMUX_Y1: R162.2 TP80.1(TP) U53.14(Y1)
I2C_DMUX_Y2: R170.2 TP82.1(TP) U53.13(Y2)
I2C_DMUX_Y3: R163.2 TP81.1(TP) U53.12(Y3)
I2C_DUT_VCC: Q12.2(SOURCE) Q13.2(SOURCE) Q16.2(SOURCE) Q17.2(SOURCE) R153.1 R160.2 R161.2 R168.2 R169.2 TP76.1(TP) U50.5(QOD) U50.6(VOUT) U52.5(QOD) U52.6(VOUT)
I2C_SCL2: D42.6(SCL2) R157.1 R164.1 R166.2 R172.1 R174.1 U56.5(IO2)
I2C_SDA2: D42.5(SDA2) R159.1 R165.1 R167.2 R173.1 R175.1 U56.3(IO1)
I2C_V_SELECT: R151.2 TP75.1(TP) U50.3(ON) U51.2(A) ; sheet LED_I2C_V_SEL/LED_DR_3V3, port I2C_CTRL.I2C_V_SELECT
I2C_V_SELECT_N: R152.2 TP77.1(TP) U51.4(Y) U52.3(ON)
MCU_SCL: D42.3(SCL1) TP78.1(TP) ; port I2C_MCU.MCU_SCL
MCU_SDA: D42.4(SDA1) TP79.1(TP) ; port I2C_MCU.MCU_SDA
PULLUP_SEL_A0: U53.1(A0) ; port I2C_CTRL.PULLUP_SEL_A0
PULLUP_SEL_A1: U53.2(A1) ; port I2C_CTRL.PULLUP_SEL_A1
PULLUP_SEL_EN: U53.6(E3) ; port I2C_CTRL.PULLUP_SEL_EN
NetC171_1: C171.1 D42.7(VREF2) D42.8(EN) R153.2
NetR157_2: R157.2 ; port I2C_DUT.DUT_SCL
NetR159_2: R159.2 ; port I2C_DUT.DUT_SDA

Not connected (* = marked no-connect by the designer): U50 4(CT)*; U51 1(NC)*; U52 4(CT)*; U53 7(Y7)* 9(Y6)* 10(Y5)* 11(Y4)*; U56 2(NC)*

### Notes on the sheet
- 0 - 3V3 selected
  1 - 5V selected
- MCU Side Signal Harness
- Control Signal Harness
- (near R152) 100k pulldowns so both power switches are OFF on startup
- 100pF filter cap for Vref2 is recommended in datasheet
- (near R153) 200k res required to stop excessive current draw. EN and Vref2 should be shorted to enable voltage translation.
- DUT Side Signal Harness
- When pulldown_EN is 0, all MOSFET gates are off. This will be done in the case of the DUT already having pulldowns on the I2C lines.
  Current can still flow through the MOSFET body diode, but in this case, the SDA/SCL lines will be 3V3/5V, and I2C_DUT_VCC will be the same, so there should be none or very little current.
- 0 - Disconnect, no pullup from I2C bus POV
  1 - Enables selection of pullup size
- Worst case Vout = Vcc - 0.5 = 2.8V
  Max Iout per pin = +-25mA
- If pullup_EN is 1
  (A1, A0) = (0, 0) = 1k
  (A1, A0) = (0, 1) = 2.2k
  (A1, A0) = (1, 0) = 4.7k
  (A1, A0) = (1, 1) = 10k
- LEDs in this section connect through 680R.
  The forward voltage of the LED is listed as between 1.7 and 2.3. At 3.3V this is 1.5-2.5mA
  At 5V:
  (5-1.7)/680 = 4.85mA drawn, still much less than LED max.

### Library data of the parts
C26 C169 C172-C176 = CMP-001-00017-6: as C162 on sheet  3V3_High_Current; Tolerance: 10%; Mounting Technology: SM; Max Operating Temperature: 125°C; RoHS Compliant: True; Pins: 2; Case/Package: 0603; Min Operating Temperature: -55°C
C168 C170 = CMP-001-00005-6: Chip Capacitor, 1 uF, +/- 10%, 25 V, 0603 (1608 Metric); Capacitor Type: Ceramic; Voltage Rating: 25V; Pins: 2; Mounting Technology: SM; RoHS Compliant: True; Max Operating Temperature: 125°C; Case/Package: 0603; Min Operating Temperature: -55°C; Tolerance: 10%
C171 = CMP-001-00144-1: 50V 100pF C0G ±1% 0603 Multilayer Ceramic Capacitors MLCC - SMD/SMT ROHS; Temperature Coefficient: 30ppm/°C; Dissipation Factor: 0.1%; Lead Free: Lead Free; Width: 800µm; Tolerance: 1%; Schedule B: 8532240020, 8532240020; Introduction Date: 2008-06-06; Harmonized Tariff Schedule (HTS) Code: 8532.24.00.20; Voltage Rating (DC): 50V; Lifecycle Status: Production; Number of Terminals: 2; Height: 800µm; REACH SVHC: Yes; Dielectric Material: Ceramic; Country of Origin: Mexico; Voltage Rating: 50V; Mounting Technology: Surface Mount; Length: 1.6mm; China RoHS: Compliant; RoHS: Compliant; Case/Package: 0603; Max Operating Temperature: 125°C; Export Control Classification Number (ECCN) Code: EAR99; Dielectric: C0G; Material: Ceramic; Min Operating Temperature: -55°C; Case Code (Imperial): 0603; Case Code (Metric): 1608; Depth: 800µm; Lead Pitch: 700µm; Packaging: Cut Tape; Termination: SMD/SMT; Thickness: 863.6µm
D42 = CMP-031-00020-1: 2-Bit Bidirectional I2C Bus and SMBus Voltage-Level Shifter; Manufacturer_Name: Texas Instruments; Mouser Price/Stock: https://www.mouser.co.uk/ProductDetail/Texas-Instruments/PCA9306DCTT?qs=wgAEGBTxy7mcoWDi%252ByJu0w%3D%3D; Mouser Part Number: 595-PCA9306DCTT; Manufacturer_Part_Number: PCA9306DCTT; Design Item ID: PCA9306DCTT; Height: 1.3mm; Datasheet Link: http://www.ti.com/lit/gpn/pca9306; Arrow Part Number: PCA9306DCTT; Arrow Price/Stock: https://www.arrow.com/en/products/pca9306dctt/texas-instruments.html?utm_currency=USD&region=nac; Source: MAX17643ATC+.SchLib
Q12 Q13 Q16 Q17 = CMP-013-00048-1: Transistor: P-MOSFET; unipolar; -30V; 4, 2A; 1, 4W; 85 mOhm; ; -55+150 st.C; SMD; SOT23; Rds On Max: 44mΩ; Turn-On Delay Time: 6.5ns; Max Junction Temperature (Tj): 150°C; Threshold Voltage: -900mV; Power Dissipation: 1.4W; Gate to Source Voltage (Vgs): 12V; Turn-Off Delay Time: 41ns; Number of Elements: 1; Continuous Drain Current (ID): 4A; Min Breakdown Voltage: 30V; Input Capacitance: 1.2nF; Drain to Source Resistance: 50mΩ; Drain to Source Voltage (Vdss): -30V; RoHS: Compliant; Export Control Classification Number (ECCN) Code: EAR99; Max Operating Temperature: 150°C; Number of Terminals: 3; Schedule B: 8541290080, 8541290080; Drain to Source Breakdown Voltage: -30V; Case/Package: TO-236-3; Introduction Date: 2007-04-10; Mounting Technology: Surface Mount; Max Power Dissipation: 1.4W; Height: 1.25mm; Lead Free: Lead Free; Min Operating Temperature: -55°C; Lifecycle Status: Production; Number of Channels: 1; Radiation Hardening: No; REACH SVHC: Yes; Pins: 3; Country of Origin: Mainland China
Q14 Q15 Q18 Q19 = CMP-013-00039-1: on Semi MMBT3904TT1G NPN Bipolar Transistor, 0.2 A, 40 V, 3-PIN SOT-416; Frequency: 300MHz; Min Operating Temperature: -55°C; Max Operating Temperature: 150°C; Case/Package: SOT-416; Pins: 3
R151 R152 R160 R161 R168 R169 = CMP-009-00345-3: Res Thick Film 0603 100K Ohm 1% 0.1W(1/10W) ±100ppm/C Pad SMD T/R Automotive; Voltage Rating: 75V; Max Power Dissipation: 100mW; Temperature Coefficient: 100ppm/°C; Max Operating Temperature: 155°C; Tolerance: 1%; Case/Package: 0603; Mounting Technology: Surface Mount; Min Operating Temperature: -55°C; Case Code (Imperial): 0603; Case Code (Metric): 1608; China RoHS: Non-Compliant; Composition: Thick Film; Country of Origin: Mainland China, Taiwan; Depth: 800µm; Export Control Classification Number (ECCN) Code: EAR99; Features: Anti-Sulfur, Automotive AEC-Q200, Moisture Resistant; Harmonized Tariff Schedule (HTS) Code: 8533.21.00.30; Height: 450µm; Introduction Date: 2012-04-10; Lead Free: Lead Free; Length: 1.6mm; Lifecycle Status: Production; Military Standard: Not; Number of Terminals: 2; Number of Terminations: 2; Packaging: Tape & Reel; Power Rating: 100mW; Ratings: AEC-Q200; REACH SVHC: Yes; RoHS: Compliant; Schedule B: 8533210045, 8533210045; Termination: SMD/SMT; Width: 800µm; Working Voltage: 75V
R153 = CMP-009-00344-1: 100mW Thin Film Resistor ±25ppm/℃ ±0.1% 200kΩ 0603 Chip Resistor - Surface Mount ROHS; Working Voltage: 75V; Temperature Coefficient: 25ppm/°C; RoHS: Compliant; Width: 800µm; Country of Origin: Mainland China, Taiwan; China RoHS: Compliant; Number of Terminations: 2; Case/Package: 0603; Composition: Thin Film; Power Rating: 100mW; Introduction Date: 2015-05-11; Harmonized Tariff Schedule (HTS) Code: 8533.21.00.30; Max Operating Temperature: 155°C; Number of Terminals: 2; Height: 450µm; Length: 1.6mm; Voltage Rating: 75V; REACH SVHC: Yes; Tolerance: 0.1%; Max Power Dissipation: 100mW; Min Operating Temperature: -55°C; Features: Anti-Sulfur, Automotive AEC-Q200, Moisture Resistant; Ratings: AEC-Q200; Mounting Technology: Surface Mount; Export Control Classification Number (ECCN) Code: EAR99; Lifecycle Status: Production
R157 R159 = CMP-009-00258-1: Res Thick Film 0603 33 Ohm 1% 0.1W(1/10W) ±100ppm/C Pad SMD T/R Automotive AEC-Q200; Voltage Rating: 75V; Max Power Dissipation: 100mW; Temperature Coefficient: 100ppm/°C; Min Operating Temperature: -55°C; Tolerance: 1%; Mounting Technology: Surface Mount; Max Operating Temperature: 155°C; Case/Package: 0603; Case Code (Imperial): 0603; China RoHS: Non-Compliant; Composition: Thick Film; Country of Origin: Mainland China, Taiwan; Export Control Classification Number (ECCN) Code: EAR99; Harmonized Tariff Schedule (HTS) Code: 8533.21.00.30; Height: 450µm; Introduction Date: 2012-04-10; Length: 1.6mm; Lifecycle Status: Production; Number of Terminals: 2; Number of Terminations: 2; Power Rating: 100mW; REACH SVHC: Yes; RoHS: Compliant; Schedule B: 8533210045, 8533210045; Termination: SMD/SMT; Width: 800µm; Working Voltage: 75V; Case Code (Metric): 1608; Features: Automotive AEC-Q200, Moisture Resistant; Packaging: Tape & Reel; Power Dissipation: 100mW; Ratings: AEC-Q200
R162 R163 R166 R167 R170 R171 = CMP-009-00322-1: as R150 on sheet  3V3_High_Current; Min Operating Temperature: -55°C; Case/Package: 0603; Mounting Technology: Surface Mount; Max Operating Temperature: 155°C; Tolerance: 0.1%; Case Code (Imperial): 0603; China RoHS: Non-Compliant; Composition: Thin Film; Country of Origin: Mainland China, Taiwan; Depth: 800µm; Export Control Classification Number (ECCN) Code: EAR99; Features: Moisture Resistant; Harmonized Tariff Schedule (HTS) Code: 8533.21.00.30; Height: 450µm; Introduction Date: 2008-06-09; Lead Free: Lead Free; Length: 1.6mm; Lifecycle Status: Production; Military Standard: Not; Number of Terminals: 2; Number of Terminations: 2; Power Rating: 100mW; REACH SVHC: Yes; RoHS: Compliant; Schedule B: 8533210045, 8533210045; Termination: SMD/SMT; Voltage Rating (DC): 75V; Weight: 2.012816mg; Width: 800µm; Working Voltage: 75V
R164 R165 = CMP-009-00292-1: 100mW Thin Film Resistor 75V ±25ppm/℃ ±0.1% 2.2kΩ 0603 Chip Resistor - Surface Mount ROHS; Voltage Rating (DC): 50V; Temperature Coefficient: 25ppm/°C; Width: 800µm; Case/Package: 0603; Lead Free: Lead Free; Voltage Rating: 75V; Max Operating Temperature: 155°C; Min Operating Temperature: -55°C; Lifecycle Status: Production; RoHS: Compliant; Schedule B: 8533210045, 8533210045; Contact Plating: Lead, Tin; Military Standard: Not; REACH SVHC: Yes; Tolerance: 0.1%; Power Rating: 100mW; Number of Terminals: 2; Height: 450µm; Length: 1.6mm; Max Power Dissipation: 100mW; Composition: Thin Film; Depth: 800µm; Number of Terminations: 2; Mounting Technology: Surface Mount; China RoHS: Non-Compliant; Features: Moisture Resistant; Case Code (Imperial): 0603; Termination: SMD/SMT; Working Voltage: 75V
R172 R173 = CMP-009-00293-1: Res Thin Film 0603 4.7K Ohm 0.1% 0.1W(1/10W) ±25ppm/C Pad SMD T/R; Temperature Coefficient: 25ppm/°C; Working Voltage: 75V; Power Rating: 100mW; Voltage Rating (DC): 50V; Tolerance: 0.1%; Country of Origin: Mainland China, Taiwan; Number of Terminations: 2; Max Operating Temperature: 155°C; Lead Free: Lead Free; Depth: 800µm; Contact Plating: Lead, Tin; Mounting Technology: Surface Mount; Max Power Dissipation: 100mW; Case Code (Imperial): 0603; Lifecycle Status: Production; Weight: 2.012816mg; Length: 1.6mm; Features: Moisture Resistant; REACH SVHC: Yes; Voltage Rating: 75V; Export Control Classification Number (ECCN) Code: EAR99; Case/Package: 0603; Min Operating Temperature: -55°C; China RoHS: Non-Compliant; Width: 800µm; Termination: SMD/SMT; Number of Terminals: 2; Military Standard: Not; Schedule B: 8533210045, 8533210045; Introduction Date: 2008-06-09; Harmonized Tariff Schedule (HTS) Code: 8533.21.00.30; Height: 450µm; Composition: Thin Film; RoHS: Compliant
R174 R175 = CMP-009-00353-1: 100mW Thin Film Resistor 75V ±25ppm/℃ ±0.1% 1kΩ 0603 Chip Resistor - Surface Mount ROHS; Voltage Rating (DC): 50V; Temperature Coefficient: 25ppm/°C; Length: 1.6mm; Depth: 800µm; Case Code (Imperial): 0603; Tolerance: 0.1%; China RoHS: Non-Compliant; Military Standard: Not; Number of Terminations: 2; Lead Free: Lead Free; Working Voltage: 75V; Case/Package: 0603; Schedule B: 8533210045, 8533210045; Number of Terminals: 2; Min Operating Temperature: -55°C; Height: 450µm; Max Operating Temperature: 155°C; Mounting Technology: Surface Mount; Width: 800µm; Composition: Thin Film; Lifecycle Status: Production; Features: Moisture Resistant; Power Rating: 100mW; Max Power Dissipation: 100mW; RoHS: Compliant; REACH SVHC: Yes; Voltage Rating: 75V; Contact Plating: Lead, Tin; Country of Origin: Mainland China, Taiwan; Export Control Classification Number (ECCN) Code: EAR99; Harmonized Tariff Schedule (HTS) Code: 8533.21.00.30; Introduction Date: 2008-06-09; Termination: SMD/SMT
TP75-TP83 = CMP-00028-00002-2: 0.6mm round; Pins: 1
U50 U52 = CMP-00000-1: 5.5-V, 2-A, 52-mΩ load switch with adj. rise time and adj. output discharge 6-SOT-23 -40 to 105; Manufacturer Lifecycle Status: ACTIVE; Max Supply Voltage: 5.5V; Turn-Off Delay Time: 2µs; Min Supply Voltage: 1V; Interface: On/Off; Rise Time: 2.54ms; Number of Drivers: 1; Turn-On Delay Time: 1.95ms; Max Output current: 2A; Output Configuration: High Side; Max Junction Temperature (Tj): 125°C; Schedule B: 8542390000, 8542390000; Length: 2.9mm; Max Operating Temperature: 105°C; Width: 1.6mm; Fall Time: 2µs; Ambient Temperature Range High: 105°C; Number of Outputs: 1; Number of Channels: 1; Thickness: 1.2mm; Lifecycle Status: Production; Lead Free: Lead Free; Case/Package: SOT-23; Height: 0m; RoHS: Compliant; Output Current: 2A; Pins: 6; Min Operating Temperature: -40°C
U51 = CMP-016-00025-1: SINGLE INVERTER GATE Inverter, LVC/LCX/Z Series, 1-Func, 1-Input, CMOS, PDSO5; Manufacturer Lifecycle Status: ACTIVE; Number of Bits: 1; Logic Function: Inverting; Nominal Supply Current: 10µA; Frequency: 150MHz; Max Output current: 32mA; Min Supply Voltage: 1.65V; Schmitt Trigger Input: No; High Level Output Current: -32mA; Max Supply Voltage: 5.5V; Turn-On Delay Time: 7.5ns; Propagation Delay: 3.7ns; Pins: 5; RoHS: Compliant; Max Operating Temperature: 125°C; Lifecycle Status: Production; Number of Gates: 1; Width: 1.6mm; Number of Outputs: 1; Min Operating Temperature: -40°C; REACH SVHC: No; Height: 1.45mm; Radiation Hardening: No; Ambient Temperature Range High: 125°C; Number of Channels: 1; Quiescent Current: 10µA; Number of Inputs: 1; Number of Elements: 1; Lead Free: Lead Free; Number of Circuits: 1; Thickness: 1.2mm; Packaging: Cut Tape; Contact Plating: Tin; Weight: 15.790684mg; Length: 2.9mm; Schedule B: 8542390000, 8542390000; Mounting Technology: Surface Mount; Output Current: 32mA; Low Level Output Current: 32mA; Termination: SMD/SMT; Case/Package: SOT-23
U53 = CMP-031-00027-2: 74HC(T)238 - 3-to-8 line decoder/demultiplexer@en-us; Manufacturer_Name: Nexperia; Height: 1.75mm; Design Item ID: 74HC238D,653; Manufacturer_Part_Number: 74HC238D,653; Mouser Part Number: 771-74HC238D-T; Arrow Part Number: 74HC238D,653; Arrow Price/Stock: https://www.arrow.com/en/products/74hc238d653/nexperia.html?utm_currency=USD&region=europe; Mouser Price/Stock: https://www.mouser.co.uk/ProductDetail/Nexperia/74HC238D653?qs=P62ublwmbi8dvjtlyD3gOA%3D%3D; Datasheet Link: https://assets.nexperia.com/documents/data-sheet/74HC_HCT238.pdf; Source: MAX17643ATC+.SchLib
U56 = CMP-004-00058-1: 11V Unidirectional 5.5V SOT-553-5 ESD and Surge Protection (TVS/ESD) ROHS; Manufacturer Lifecycle Status: ACTIVE; Leakage Current: 1nA; Power Line Protection: Yes; Interface: Ethernet, LVDS; Element Configuration: Dual; Number of Channels: 2; Min Supply Voltage: 900mV; Clamping Voltage: 105.5V; Max Junction Temperature (Tj): 150°C; Peak Pulse Current: 10A; Value: 1.5pF; REACH SVHC: No; Width: 1.2mm; Weight: 2.806603mg; Pins: 5; Min Operating Temperature: -40°C; Breakdown Voltage: 11V; Lifecycle Status: Production; RoHS: Compliant; Termination: SMD/SMT; Working Voltage: 5.5V; Radiation Hardening: No; Thickness: 550µm; Length: 1.6mm; Contact Plating: Gold; Number of Outputs: 2; Max Operating Temperature: 85°C; Height: 0m; Min Breakdown Voltage: 11V; Polarity: Unidirectional; Ambient Temperature Range High: 85°C; Lead Free: Lead Free; Depth: 1.2mm; Schedule B: 8541100080, 8541100080; Reverse Standoff Voltage: 5.5V; Operating Supply Voltage: 5.5V; Max Supply Voltage: 5.5V; Number of Bidirectional Channels: 2; Direction: Unidirectional; Case/Package: SOT

## Sheet  Output_Expander_IC.SchDoc
size A4; SheetNumber: 29; SheetTotal: 29
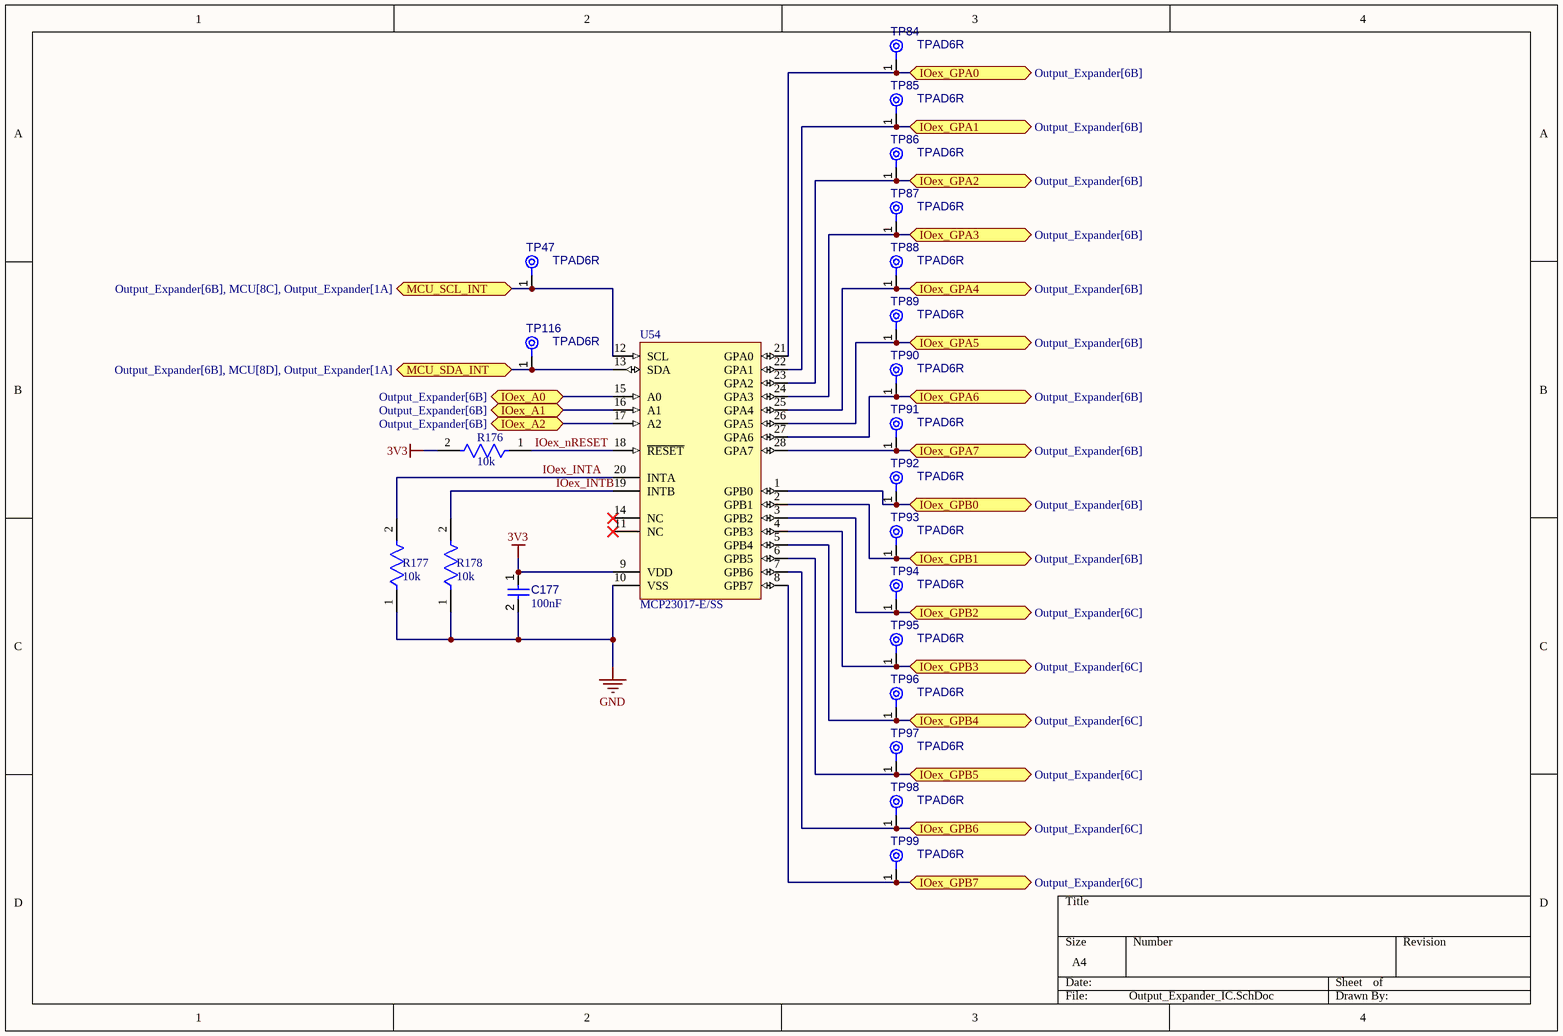
[diagram p27:  Output_Expander_IC.SchDoc]

### Parts
C177  value 100nF  [CAPC1608X90X40NL10T20]  (hidden comment: Capacitor 100 nF +/-10% 50 V 0603)
R176  value 10k  [FP-RT0603-IPC_C]  (hidden comment: RT0603BRD0710KL)
R177  value 10k  [FP-RT0603-IPC_C]  (hidden comment: RT0603BRD0710KL)
R178  value 10k  [FP-RT0603-IPC_C]  (hidden comment: RT0603BRD0710KL)
TP47  TPAD6R  [TP06R]  (no BOM)
TP84  TPAD6R  [TP06R]  (no BOM)
TP85  TPAD6R  [TP06R]  (no BOM)
TP86  TPAD6R  [TP06R]  (no BOM)
TP87  TPAD6R  [TP06R]  (no BOM)
TP88  TPAD6R  [TP06R]  (no BOM)
TP89  TPAD6R  [TP06R]  (no BOM)
TP90  TPAD6R  [TP06R]  (no BOM)
TP91  TPAD6R  [TP06R]  (no BOM)
TP92  TPAD6R  [TP06R]  (no BOM)
TP93  TPAD6R  [TP06R]  (no BOM)
TP94  TPAD6R  [TP06R]  (no BOM)
TP95  TPAD6R  [TP06R]  (no BOM)
TP96  TPAD6R  [TP06R]  (no BOM)
TP97  TPAD6R  [TP06R]  (no BOM)
TP98  TPAD6R  [TP06R]  (no BOM)
TP99  TPAD6R  [TP06R]  (no BOM)
TP116  TPAD6R  [TP06R]  (no BOM)
U54  MCP23017-E/SS  [SSOP-SS28_M]

### Ports
IOex_A0 (bidir, see Output_Expander[6B]), IOex_A1 (bidir, see Output_Expander[6B]), IOex_A2 (bidir, see Output_Expander[6B]), IOex_GPA0 (bidir, see Output_Expander[6B]), IOex_GPA1 (bidir, see Output_Expander[6B]), IOex_GPA2 (bidir, see Output_Expander[6B]), IOex_GPA3 (bidir, see Output_Expander[6B]), IOex_GPA4 (bidir, see Output_Expander[6B]), IOex_GPA5 (bidir, see Output_Expander[6B]), IOex_GPA6 (bidir, see Output_Expander[6B]), IOex_GPA7 (bidir, see Output_Expander[6B]), IOex_GPB0 (bidir, see Output_Expander[6B]), IOex_GPB1 (bidir, see Output_Expander[6B]), IOex_GPB2 (bidir, see Output_Expander[6C]), IOex_GPB3 (bidir, see Output_Expander[6C]), IOex_GPB4 (bidir, see Output_Expander[6C]), IOex_GPB5 (bidir, see Output_Expander[6C]), IOex_GPB6 (bidir, see Output_Expander[6C]), IOex_GPB7 (bidir, see Output_Expander[6C]), MCU_SCL_INT (bidir, see Output_Expander[6B], MCU[8C], Output_Expander[1A]), MCU_SDA_INT (bidir, see Output_Expander[6B], MCU[8D], Output_Expander[1A])

### Nets
3V3: C177.1 R176.2 U54.9(VDD)
GND: C177.2 R177.1 R178.1 U54.10(VSS)
IOex_INTA: R177.2 U54.20(INTA)
IOex_INTB: R178.2 U54.19(INTB)
IOex_nRESET: R176.1 U54.18(~{RESET})
NetTP47_1: TP47.1(TP) U54.12(SCL) ; port MCU_SCL_INT
NetTP84_1: TP84.1(TP) U54.21(GPA0) ; port IOex_GPA0
NetTP85_1: TP85.1(TP) U54.22(GPA1) ; port IOex_GPA1
NetTP86_1: TP86.1(TP) U54.23(GPA2) ; port IOex_GPA2
NetTP87_1: TP87.1(TP) U54.24(GPA3) ; port IOex_GPA3
NetTP88_1: TP88.1(TP) U54.25(GPA4) ; port IOex_GPA4
NetTP89_1: TP89.1(TP) U54.26(GPA5) ; port IOex_GPA5
NetTP90_1: TP90.1(TP) U54.27(GPA6) ; port IOex_GPA6
NetTP91_1: TP91.1(TP) U54.28(GPA7) ; port IOex_GPA7
NetTP92_1: TP92.1(TP) U54.1(GPB0) ; port IOex_GPB0
NetTP93_1: TP93.1(TP) U54.2(GPB1) ; port IOex_GPB1
NetTP94_1: TP94.1(TP) U54.3(GPB2) ; port IOex_GPB2
NetTP95_1: TP95.1(TP) U54.4(GPB3) ; port IOex_GPB3
NetTP96_1: TP96.1(TP) U54.5(GPB4) ; port IOex_GPB4
NetTP97_1: TP97.1(TP) U54.6(GPB5) ; port IOex_GPB5
NetTP98_1: TP98.1(TP) U54.7(GPB6) ; port IOex_GPB6
NetTP99_1: TP99.1(TP) U54.8(GPB7) ; port IOex_GPB7
NetTP116_1: TP116.1(TP) U54.13(SDA) ; port MCU_SDA_INT
NetU54_15: U54.15(A0) ; port IOex_A0
NetU54_16: U54.16(A1) ; port IOex_A1
NetU54_17: U54.17(A2) ; port IOex_A2

Not connected (* = marked no-connect by the designer): U54 11(NC)* 14(NC)*

### Library data of the parts
C177 = CMP-001-00017-6: as C162 on sheet  3V3_High_Current; Tolerance: 10%; Mounting Technology: SM; Max Operating Temperature: 125°C; RoHS Compliant: True; Pins: 2; Case/Package: 0603; Min Operating Temperature: -55°C
R176-R178 = CMP-009-00322-1: as R150 on sheet  3V3_High_Current; Min Operating Temperature: -55°C; Case/Package: 0603; Mounting Technology: Surface Mount; Max Operating Temperature: 155°C; Tolerance: 0.1%; Case Code (Imperial): 0603; China RoHS: Non-Compliant; Composition: Thin Film; Country of Origin: Mainland China, Taiwan; Depth: 800µm; Export Control Classification Number (ECCN) Code: EAR99; Features: Moisture Resistant; Harmonized Tariff Schedule (HTS) Code: 8533.21.00.30; Height: 450µm; Introduction Date: 2008-06-09; Lead Free: Lead Free; Length: 1.6mm; Lifecycle Status: Production; Military Standard: Not; Number of Terminals: 2; Number of Terminations: 2; Power Rating: 100mW; REACH SVHC: Yes; RoHS: Compliant; Schedule B: 8533210045, 8533210045; Termination: SMD/SMT; Voltage Rating (DC): 75V; Weight: 2.012816mg; Width: 800µm; Working Voltage: 75V
TP47 TP84-TP99 TP116 = CMP-00028-00002-2: 0.6mm round; Pins: 1
U54 = CMP-031-00018-1: I²C Bus IC Operating temperature: -40...+125 °C Power supply: 1.8...5.5 V Package: SSOP-20; Manufacturer Lifecycle Status: REL; Number of I/Os: 16; Interface: I2C, Serial; Frequency: 1.7MHz; Max Supply Voltage: 5.5V; Max Power Dissipation: 700mW; Output Current: 25mA; Min Supply Voltage: 4.5V; Nominal Supply Current: 1mA; Projected EOL Date: 2034-06-24; Schedule B: 8542390000, 8542390000; Mounting Technology: Surface Mount; Packaging: Bulk; RoHS: Compliant; Case/Package: SSOP; Lead Free: Lead Free; HS Code: 8542.39.0090; Country of Fabrication: United States of America; Introduction Date: 2005-06-24; Export Control Classification Number (ECCN) Code: EAR99; Lifecycle Status: Production; Country of Origin: Philippines, Thailand; Pins: 28; Number of Bits: 16; Clock Frequency: 1.7MHz; Min Operating Temperature: -40°C; Max Operating Temperature: 125°C; Weight: 2.26799g; Harmonized Tariff Schedule (HTS) Code: 8542.39.0060; Country of Assembly: Philippines, Thailand; REACH SVHC: No